# Altium project UCLA-DRS4.PrjPCB (part 3 of 10)

## Sheet DRS4_ADC.SchDoc: My title
size A3; Organization: University of California; Address1: 475 Portola Plaza; Address2: Los Angeles, CA 90095; DocumentNumber: 22; Revision: R01; SheetNumber: 22; SheetTotal: 35
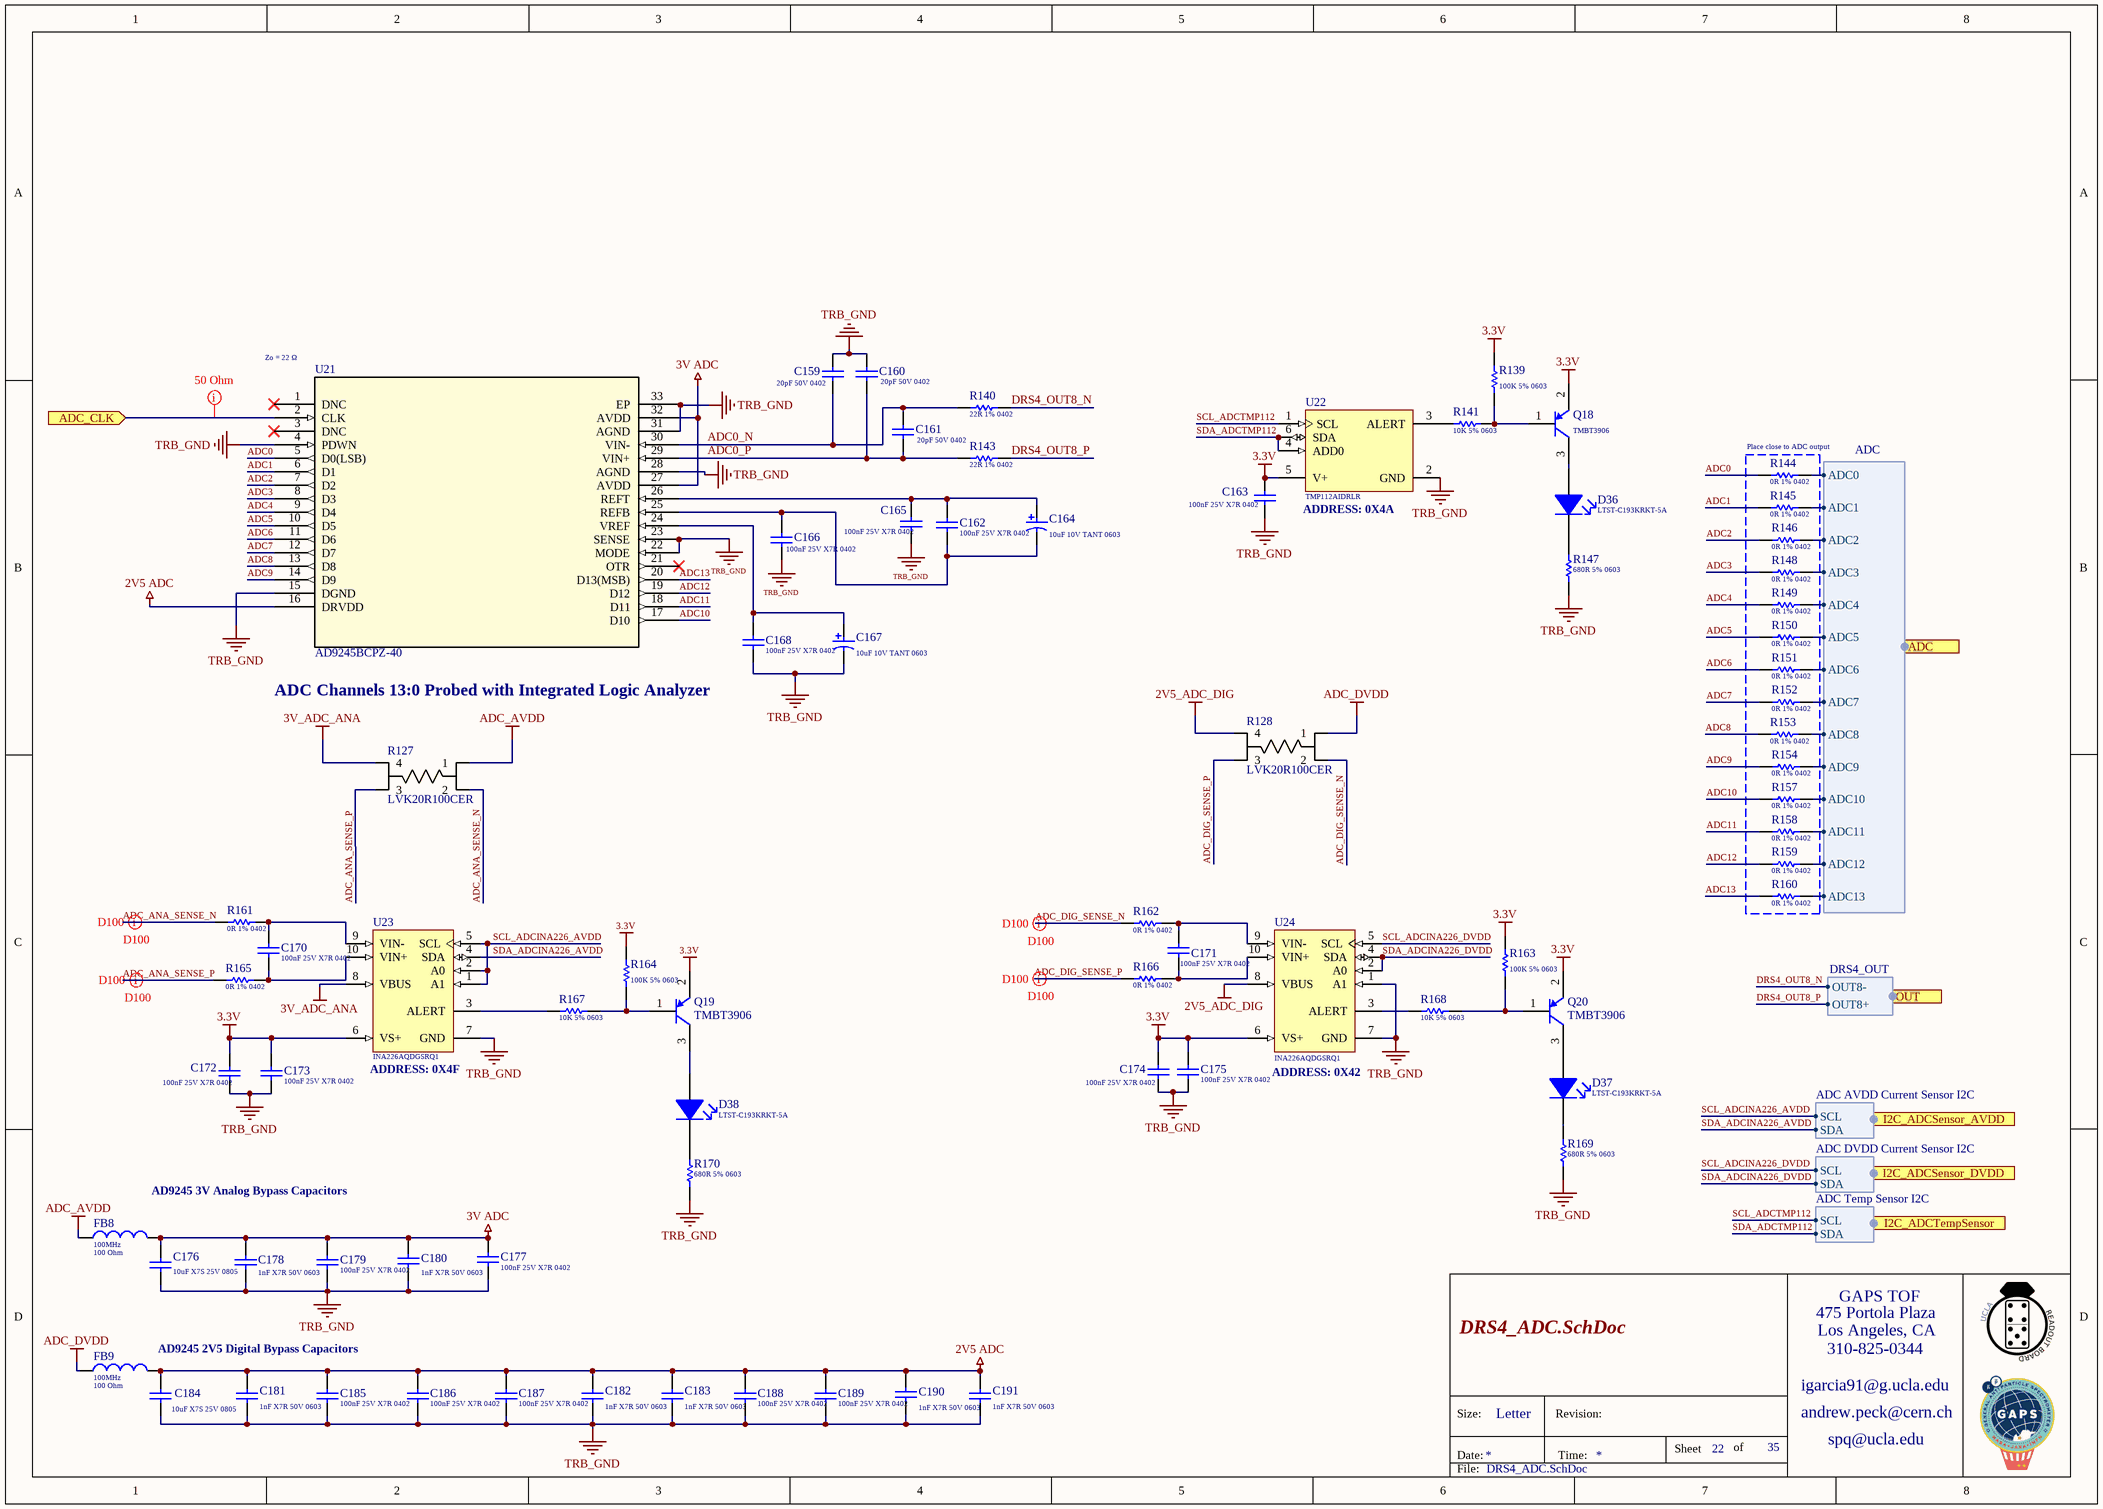
[diagram p4: DRS4_ADC.SchDoc]

### Parts
C159  Capacitance: 20pF 50V 0402  [Cap_Murata_GJM1555C1H200GB01D_20pF]  (hidden comment: Cap_Murata_GJM1555C1H200GB01D_20pF)
C160  Capacitance: 20pF 50V 0402  [Cap_Murata_GJM1555C1H200GB01D_20pF]  (hidden comment: Cap_Murata_GJM1555C1H200GB01D_20pF)
C161  Capacitance: 20pF 50V 0402  [Cap_Murata_GJM1555C1H200GB01D_20pF]  (hidden comment: Cap_Murata_GJM1555C1H200GB01D_20pF)
C162  Capacitance: 100nF 25V X7R 0402  [Cap_Taiyo_Yuden_TMK105B7104KV-FR_100nF]  (hidden comment: Cap_Taiyo_Yuden_TMK105B7104KV-FR_100nF)
C163  Capacitance: 100nF 25V X7R 0402  [Cap_Taiyo_Yuden_TMK105B7104KV-FR_100nF]  (hidden comment: Cap_Taiyo_Yuden_TMK105B7104KV-FR_100nF)
C164  10uF 10V TANT 0603  [VISH-TR8-M_L]
C165  Capacitance: 100nF 25V X7R 0402  [Cap_Taiyo_Yuden_TMK105B7104KV-FR_100nF]  (hidden comment: Cap_Taiyo_Yuden_TMK105B7104KV-FR_100nF)
C166  Capacitance: 100nF 25V X7R 0402  [Cap_Taiyo_Yuden_TMK105B7104KV-FR_100nF]  (hidden comment: Cap_Taiyo_Yuden_TMK105B7104KV-FR_100nF)
C167  10uF 10V TANT 0603  [VISH-TR8-M_L]
C168  Capacitance: 100nF 25V X7R 0402  [Cap_Taiyo_Yuden_TMK105B7104KV-FR_100nF]  (hidden comment: Cap_Taiyo_Yuden_TMK105B7104KV-FR_100nF)
C170  Capacitance: 100nF 25V X7R 0402  [Cap_Taiyo_Yuden_TMK105B7104KV-FR_100nF]  (hidden comment: Cap_Taiyo_Yuden_TMK105B7104KV-FR_100nF)
C171  Capacitance: 100nF 25V X7R 0402  [Cap_Taiyo_Yuden_TMK105B7104KV-FR_100nF]  (hidden comment: Cap_Taiyo_Yuden_TMK105B7104KV-FR_100nF)
C172  Capacitance: 100nF 25V X7R 0402  [Cap_Taiyo_Yuden_TMK105B7104KV-FR_100nF]  (hidden comment: Cap_Taiyo_Yuden_TMK105B7104KV-FR_100nF)
C173  Capacitance: 100nF 25V X7R 0402  [Cap_Taiyo_Yuden_TMK105B7104KV-FR_100nF]  (hidden comment: Cap_Taiyo_Yuden_TMK105B7104KV-FR_100nF)
C174  Capacitance: 100nF 25V X7R 0402  [Cap_Taiyo_Yuden_TMK105B7104KV-FR_100nF]  (hidden comment: Cap_Taiyo_Yuden_TMK105B7104KV-FR_100nF)
C175  Capacitance: 100nF 25V X7R 0402  [Cap_Taiyo_Yuden_TMK105B7104KV-FR_100nF]  (hidden comment: Cap_Taiyo_Yuden_TMK105B7104KV-FR_100nF)
C176  Capacitance: 10uF X7S 25V 0805  [Cap_Murata_ GRM21BC71E106ME11L_10uF]  (hidden comment: Cap_Murata_ GRM21BC71E106ME11L_10uF)
C177  Capacitance: 100nF 25V X7R 0402  [Cap_Taiyo_Yuden_TMK105B7104KV-FR_100nF]  (hidden comment: Cap_Taiyo_Yuden_TMK105B7104KV-FR_100nF)
C178  Capacitance: 1nF X7R 50V 0603  [Cap_Kemet_C0603C102J5RACAUTO_1nF]  (hidden comment: Cap_Kemet_C0603C102J5RACAUTO_1nF)
C179  Capacitance: 100nF 25V X7R 0402  [Cap_Taiyo_Yuden_TMK105B7104KV-FR_100nF]  (hidden comment: Cap_Taiyo_Yuden_TMK105B7104KV-FR_100nF)
C180  Capacitance: 1nF X7R 50V 0603  [Cap_Kemet_C0603C102J5RACAUTO_1nF]  (hidden comment: Cap_Kemet_C0603C102J5RACAUTO_1nF)
C181  Capacitance: 1nF X7R 50V 0603  [Cap_Kemet_C0603C102J5RACAUTO_1nF]  (hidden comment: Cap_Kemet_C0603C102J5RACAUTO_1nF)
C182  Capacitance: 1nF X7R 50V 0603  [Cap_Kemet_C0603C102J5RACAUTO_1nF]  (hidden comment: Cap_Kemet_C0603C102J5RACAUTO_1nF)
C183  Capacitance: 1nF X7R 50V 0603  [Cap_Kemet_C0603C102J5RACAUTO_1nF]  (hidden comment: Cap_Kemet_C0603C102J5RACAUTO_1nF)
C184  Capacitance: 10uF X7S 25V 0805  [Cap_Murata_ GRM21BC71E106ME11L_10uF]  (hidden comment: Cap_Murata_ GRM21BC71E106ME11L_10uF)
C185  Capacitance: 100nF 25V X7R 0402  [Cap_Taiyo_Yuden_TMK105B7104KV-FR_100nF]  (hidden comment: Cap_Taiyo_Yuden_TMK105B7104KV-FR_100nF)
C186  Capacitance: 100nF 25V X7R 0402  [Cap_Taiyo_Yuden_TMK105B7104KV-FR_100nF]  (hidden comment: Cap_Taiyo_Yuden_TMK105B7104KV-FR_100nF)
C187  Capacitance: 100nF 25V X7R 0402  [Cap_Taiyo_Yuden_TMK105B7104KV-FR_100nF]  (hidden comment: Cap_Taiyo_Yuden_TMK105B7104KV-FR_100nF)
C188  Capacitance: 100nF 25V X7R 0402  [Cap_Taiyo_Yuden_TMK105B7104KV-FR_100nF]  (hidden comment: Cap_Taiyo_Yuden_TMK105B7104KV-FR_100nF)
C189  Capacitance: 100nF 25V X7R 0402  [Cap_Taiyo_Yuden_TMK105B7104KV-FR_100nF]  (hidden comment: Cap_Taiyo_Yuden_TMK105B7104KV-FR_100nF)
C190  Capacitance: 1nF X7R 50V 0603  [Cap_Kemet_C0603C102J5RACAUTO_1nF]  (hidden comment: Cap_Kemet_C0603C102J5RACAUTO_1nF)
C191  Capacitance: 1nF X7R 50V 0603  [Cap_Kemet_C0603C102J5RACAUTO_1nF]  (hidden comment: Cap_Kemet_C0603C102J5RACAUTO_1nF)
D36  LTST-C193KRKT-5A  [Led_Lite-On_LTST-C193KGKT-5A_Red]
D37  LTST-C193KRKT-5A  [Led_Lite-On_LTST-C193KGKT-5A_Red]
D38  LTST-C193KRKT-5A  [Led_Lite-On_LTST-C193KGKT-5A_Red]
FB8  Measuring Frequency: 100MHz  Impedance: 100 Ohm  [FB_Wurth_Electronics_742792731_100Ohms]  (hidden comment: 742792731)
FB9  Measuring Frequency: 100MHz  Impedance: 100 Ohm  [FB_Wurth_Electronics_742792731_100Ohms]  (hidden comment: 742792731)
Q18  Series: TMBT3906  [BJT_PNP_Toshiba_TMBT3906]  (hidden comment: BJT_PNP_Toshiba_TMBT3906)
Q19  Series: TMBT3906  [BJT_PNP_Toshiba_TMBT3906]  (hidden comment: BJT_PNP_Toshiba_TMBT3906)
Q20  Series: TMBT3906  [BJT_PNP_Toshiba_TMBT3906]  (hidden comment: BJT_PNP_Toshiba_TMBT3906)
R127  LVK20R100CER  [OH_LVK20_OHM]
R128  LVK20R100CER  [OH_LVK20_OHM]
R139  100K 5% 0603  [RESC0603(1608)_N]
R140  22R 1% 0402  [RESC0402(1005)_L]
R141  10K 5% 0603  [RESC0603(1608)_L]
R143  22R 1% 0402  [RESC0402(1005)_L]
R144  Resistance: 0R 1% 0402  [Res_Vishay_CRCW04020000Z0EDC_0_Ohm]  (hidden comment: Res_Vishay_CRCW04020000Z0EDC_0_Ohm)
R145  Resistance: 0R 1% 0402  [Res_Vishay_CRCW04020000Z0EDC_0_Ohm]  (hidden comment: Res_Vishay_CRCW04020000Z0EDC_0_Ohm)
R146  Resistance: 0R 1% 0402  [Res_Vishay_CRCW04020000Z0EDC_0_Ohm]  (hidden comment: Res_Vishay_CRCW04020000Z0EDC_0_Ohm)
R147  680R 5% 0603  [RESC0603(1608)_L]
R148  Resistance: 0R 1% 0402  [Res_Vishay_CRCW04020000Z0EDC_0_Ohm]  (hidden comment: Res_Vishay_CRCW04020000Z0EDC_0_Ohm)
R149  Resistance: 0R 1% 0402  [Res_Vishay_CRCW04020000Z0EDC_0_Ohm]  (hidden comment: Res_Vishay_CRCW04020000Z0EDC_0_Ohm)
R150  Resistance: 0R 1% 0402  [Res_Vishay_CRCW04020000Z0EDC_0_Ohm]  (hidden comment: Res_Vishay_CRCW04020000Z0EDC_0_Ohm)
R151  Resistance: 0R 1% 0402  [Res_Vishay_CRCW04020000Z0EDC_0_Ohm]  (hidden comment: Res_Vishay_CRCW04020000Z0EDC_0_Ohm)
R152  Resistance: 0R 1% 0402  [Res_Vishay_CRCW04020000Z0EDC_0_Ohm]  (hidden comment: Res_Vishay_CRCW04020000Z0EDC_0_Ohm)
R153  Resistance: 0R 1% 0402  [Res_Vishay_CRCW04020000Z0EDC_0_Ohm]  (hidden comment: Res_Vishay_CRCW04020000Z0EDC_0_Ohm)
R154  Resistance: 0R 1% 0402  [Res_Vishay_CRCW04020000Z0EDC_0_Ohm]  (hidden comment: Res_Vishay_CRCW04020000Z0EDC_0_Ohm)
R157  Resistance: 0R 1% 0402  [Res_Vishay_CRCW04020000Z0EDC_0_Ohm]  (hidden comment: Res_Vishay_CRCW04020000Z0EDC_0_Ohm)
R158  Resistance: 0R 1% 0402  [Res_Vishay_CRCW04020000Z0EDC_0_Ohm]  (hidden comment: Res_Vishay_CRCW04020000Z0EDC_0_Ohm)
R159  Resistance: 0R 1% 0402  [Res_Vishay_CRCW04020000Z0EDC_0_Ohm]  (hidden comment: Res_Vishay_CRCW04020000Z0EDC_0_Ohm)
R160  Resistance: 0R 1% 0402  [Res_Vishay_CRCW04020000Z0EDC_0_Ohm]  (hidden comment: Res_Vishay_CRCW04020000Z0EDC_0_Ohm)
R161  Resistance: 0R 1% 0402  [Res_Vishay_CRCW04020000Z0EDC_0_Ohm]  (hidden comment: Res_Vishay_CRCW04020000Z0EDC_0_Ohm)
R162  Resistance: 0R 1% 0402  [Res_Vishay_CRCW04020000Z0EDC_0_Ohm]  (hidden comment: Res_Vishay_CRCW04020000Z0EDC_0_Ohm)
R163  100K 5% 0603  [RESC0603(1608)_N]
R164  100K 5% 0603  [RESC0603(1608)_N]
R165  Resistance: 0R 1% 0402  [Res_Vishay_CRCW04020000Z0EDC_0_Ohm]  (hidden comment: Res_Vishay_CRCW04020000Z0EDC_0_Ohm)
R166  Resistance: 0R 1% 0402  [Res_Vishay_CRCW04020000Z0EDC_0_Ohm]  (hidden comment: Res_Vishay_CRCW04020000Z0EDC_0_Ohm)
R167  10K 5% 0603  [RESC0603(1608)_L]
R168  10K 5% 0603  [RESC0603(1608)_L]
R169  680R 5% 0603  [RESC0603(1608)_L]
R170  680R 5% 0603  [RESC0603(1608)_L]
U21  AD9245  [CP_32_2]  (value not drawn)
U22  TMP112AIDRLR  [TMP112AIDRLR]
U23  INA226AQDGSRQ1  [INA226AQDGSRQ1]
U24  INA226AQDGSRQ1  [INA226AQDGSRQ1]

### Blocks framed on the sheet
Place close to ADC output: R144-R146 R148-R154 R157-R160

### Ports
ADC (harness ADC), ADC_CLK (in), I2C_ADCSensor_AVDD (harness ADC AVDD Current Sensor I2C), I2C_ADCSensor_DVDD (harness ADC DVDD Current Sensor I2C), I2C_ADCTempSensor (harness ADC Temp Sensor I2C), OUT (harness DRS4_OUT)

### Harnesses
ADC: ADC0, ADC1, ADC2, ADC3, ADC4, ADC5, ADC6, ADC7, ADC8, ADC9, ADC10, ADC11, ADC12, ADC13
DRS4_OUT: OUT8+, OUT8-
ADC AVDD Current Sensor I2C: SCL, SDA
ADC Temp Sensor I2C: SCL, SDA
ADC DVDD Current Sensor I2C: SCL, SDA

### Nets
2V5 ADC: C181.2 C182.2 C183.2 C184.1 C185.1 C186.1 C187.1 C188.1 C189.1 C190.2 C191.2 FB9.2 U21.16(DRVDD)
2V5_ADC_DIG: R128.4 U24.8(VBUS)
3.3V: C163.1 C172.2 C173.2 C174.2 C175.2 Q18.2(E) Q19.2(E) Q20.2(E) R139.2 R163.2 R164.2 U22.5(V+) U23.6(VS+) U24.6(VS+)
3V ADC: C176.1 C177.1 C178.2 C179.1 C180.2 FB8.2 U21.27(AVDD) U21.32(AVDD)
3V_ADC_ANA: R127.4 U23.8(VBUS)
ADC_AVDD: FB8.1 R127.1
ADC_DVDD: FB9.1 R128.1
TRB_GND: C159.2 C160.2 C163.2 C165.2 C166.2 C167.2 C168.2 C172.1 C173.1 C174.1 C175.1 C176.2 C177.2 C178.1 C179.2 C180.1 C181.1 C182.1 C183.1 C184.2 C185.2 C186.2 C187.2 C188.2 C189.2 C190.1 C191.1 R147.1 R169.1 R170.1 U21.4(PDWN) U21.15(DGND) U21.22(MODE) U21.23(SENSE) U21.28(AGND) U21.31(AGND) U21.33(EP) U22.2(GND) U23.7(GND) U24.1(A1) U24.7(GND)
ADC0: R144.1 U21.5(D0(LSB))
ADC0_N: C159.1 C161.2 R140.2 U21.30(VIN-)
ADC0_P: C160.1 C161.1 R143.2 U21.29(VIN+)
ADC1: R145.1 U21.6(D1)
ADC2: R146.1 U21.7(D2)
ADC3: R148.1 U21.8(D3)
ADC4: R149.1 U21.9(D4)
ADC5: R150.1 U21.10(D5)
ADC6: R151.1 U21.11(D6)
ADC7: R152.1 U21.12(D7)
ADC8: R153.1 U21.13(D8)
ADC9: R154.1 U21.14(D9)
ADC10: R157.1 U21.17(D10)
ADC11: R158.1 U21.18(D11)
ADC12: R159.1 U21.19(D12)
ADC13: R160.1 U21.20(D13(MSB))
ADC_ANA_SENSE_N: R127.2 R161.1
ADC_ANA_SENSE_P: R127.3 R165.1
ADC_CLK: U21.2(CLK) ; port ADC_CLK
ADC_DIG_SENSE_N: R128.2 R162.1
ADC_DIG_SENSE_P: R128.3 R166.1
DRS4_OUT8_N: R140.1 ; port OUT.OUT8-
DRS4_OUT8_P: R143.1 ; port OUT.OUT8+
IO_B34_L7_Y16_P: R157.2 ; port ADC.ADC10
IO_B34_L7_Y17_N: R154.2 ; port ADC.ADC9
IO_B34_L10_V15_P: R159.2 ; port ADC.ADC12
IO_B34_L10_W15_N: R158.2 ; port ADC.ADC11
IO_B34_L17_Y18_P: R153.2 ; port ADC.ADC8
IO_B34_L17_Y19_N: R152.2 ; port ADC.ADC7
IO_B34_L19_R17_N: R160.2 ; port ADC.ADC13
IO_B34_L22_W18_P: R151.2 ; port ADC.ADC6
IO_B34_L22_W19_N: R150.2 ; port ADC.ADC5
IO_B35_L7_M19_P: R146.2 ; port ADC.ADC2
IO_B35_L7_M20_N: R145.2 ; port ADC.ADC1
IO_B35_L9_L19_P: R144.2 ; port ADC.ADC0
IO_B35_L21_N15_P: R149.2 ; port ADC.ADC4
IO_B35_L21_N16_N: R148.2 ; port ADC.ADC3
SCL_ADCINA226_AVDD: U23.1(A1) U23.2(A0) U23.5(SCL) ; port I2C_ADCSensor_AVDD.SCL
SCL_ADCINA226_DVDD: U24.5(SCL) ; port I2C_ADCSensor_DVDD.SCL
SCL_ADCTMP112: U22.1(SCL) ; port I2C_ADCTempSensor.SCL
SDA_ADCINA226_AVDD: U23.4(SDA) ; port I2C_ADCSensor_AVDD.SDA
SDA_ADCINA226_DVDD: U24.2(A0) U24.4(SDA) ; port I2C_ADCSensor_DVDD.SDA
SDA_ADCTMP112: U22.4(ADD0) U22.6(SDA) ; port I2C_ADCTempSensor.SDA
NetC162_1: C162.1 C164.2 C166.1 U21.25(REFB)
NetC162_2: C162.2 C164.1 C165.1 U21.26(REFT)
NetC167_1: C167.1 C168.1 U21.24(VREF)
NetC170_1: C170.1 R165.2 U23.10(VIN+)
NetC170_2: C170.2 R161.2 U23.9(VIN-)
NetC171_1: C171.1 R166.2 U24.10(VIN+)
NetC171_2: C171.2 R162.2 U24.9(VIN-)
NetD36_1: D36.1(K) R147.2
NetD36_2: D36.2(A) Q18.3(C)
NetD37_1: D37.1(K) R169.2
NetD37_2: D37.2(A) Q20.3(C)
NetD38_1: D38.1(K) R170.2
NetD38_2: D38.2(A) Q19.3(C)
NetQ18_1: Q18.1(B) R139.1 R141.1
NetQ19_1: Q19.1(B) R164.1 R167.1
NetQ20_1: Q20.1(B) R163.1 R168.1
NetR141_2: R141.2 U22.3(ALERT)
NetR167_2: R167.2 U23.3(ALERT)
NetR168_2: R168.2 U24.3(ALERT)

Not connected (* = marked no-connect by the designer): U21 1(DNC)* 3(DNC)* 21(OTR)*

### Layout directives
net class S50: ADC_CLK
differential pair; differential pair class D100: ADC_ANA_SENSE_N, ADC_ANA_SENSE_P, ADC_DIG_SENSE_N, ADC_DIG_SENSE_P

### Notes on the sheet
- (near U21) Zo = 22 Ω
- ADDRESS: 0X4A
- (near C168) ADC Channels 13:0 Probed with Integrated Logic Analyzer
- D100
- (near U23) ADDRESS: 0X4F
- (near U24) ADDRESS: 0X42
- AD9245 3V Analog Bypass Capacitors
- (near FB9) AD9245 2V5 Digital Bypass Capacitors
- 475 Portola Plaza
- GAPS TOF
- igarcia91@g.ucla.edu
- Los Angeles, CA
- 310-825-0344
- Size:
- Date:
- Letter
- Revision:
- Time:
- Sheet
- of
- andrew.peck@cern.ch
- spq@ucla.edu
- File:

### Library data of the parts
C159-C161 = Cap_Murata_GJM1555C1H200GB01D_20pF: Multilayer Ceramic Capacitors MLCC - SMD/SMT 0402 20pF 50Volts C0G 2%; Supplier 1: Mouser; Supplier Part Number 1: 81-GJM1555C1H200GB01
C162 C163 C165 C166 C168 C170-C175 C177 C179 C185-C189 = Cap_Taiyo_Yuden_TMK105B7104KV-FR_100nF: CAP CER 100nF 25V X7R 0402; Supplier 1: Mouser; Supplier Part Number 1: 963-TMK105B7104KV-FR
C164 C167 = CMP-2000-07316-1: Tantalum Capacitor, 10 uF, +/- 20%, 10 V, -55 to 125 degC, 2-Pin SMD (M), RoHS, Tape and Reel; Manufacturer: Vishay; Manufacturer Part Number: TR8M106M010C2000; Capacitance: 10µF; Featured Product: TR8SeriesMoldedMicroTan™TantalumChipCapacitors; ESR (Equivalent Series Resistance): 2Ohm; Other Names: 718-1673-6; Catalog Drawings: TR8SeriesTR8SeriesBottom; Online Catalog: MICROTAN®TR8Series; Type: Molded; Mounting Technology: SurfaceMount; Category: Capacitors; Lifetime @ Temp.: -; Package Reference: TR8-M; Size / Dimension: 0.063"Lx0.033"W(1.60mmx0.85mm); Operating Temperature: -55°C~125°C; Mounting Type: SurfaceMount; Lead Spacing: -; Tolerance: ±20%; Standard Package: 1; Datasheet URL: http://www.vishay.com/docs/40114/tr8.pdf; Package Description: 2-Pin Surface Mount Device, Body 1.6 x 0.85 mm; Height - Seated (Max): 0.035"(0.89mm); Family: TantalumCapacitors; Manufacturer Size Code: M; Voltage - Rated: 10V; Series: MICROTAN®TR8; Packaging: Digi-Reel®; Manufacturer URL: http://www.vishay.com/; Datasheet Version: 03/2016; Package / Case: 0603(1608Metric); Features: GeneralPurpose
C176 C184 = Cap_Murata_ GRM21BC71E106ME11L_10uF: CAP CER 10uF 25V X7R 0805; Supplier 1: Mouser; Supplier Part Number 1: 81-GRM21BC71E106ME1L
C178 C180-C183 C190 C191 = Cap_Kemet_C0603C102J5RACAUTO_1nF: CAP CER 1nF 50V X7R 0603; Supplier 1: Mouser; Supplier Part Number 1: 80-C0603C102J5RAUTO
D36-D38 = Led_Lite-On_LTST-C193KGKT-5A_Red: Standard LEDs - SMD Red 470nm 28mcd 20mA; Supplier 1: Mouser; Supplier Part Number 1: 859-LTSTC193KRKT5A; Series: LTST-C193KRKT-5A
FB8 FB9 = FB_Wurth_Electronics_742792731_100Ohms: FB SMD 100 OHM 25% 1.2A 0402; DC Resistance: 90mOhm; Supplier 1: Mouser; Supplier Part Number 1: 710-742792731
Q18-Q20 = BJT_PNP_Toshiba_TMBT3906: Bipolar Transistors - BJT Transistor for Low Freq. Amplification; Manufacturer Part Number 1: TMBT3906,LM; Supplier 1: Mouser; Supplier Part Number 1: 757-TMBT3906LM; Manufacturer: Toshiba
R127 R128 = LVK20R100CER: Current Sense Resistors - SMD .1 OHM.25% 3/4W; Vendor: Ohmite; Built_By: EMA_UL_Team; SourceLibrary: Ohmite_2014-12-31; Manufacturer_Part_Number: LVK20R100CER; Copyright: Copyright (C) 2018 Accelerated Designs. All rights reserved; RefDes: RefDes; Type: DEV
R139 R163 R164 = CMP-1012-00122-1: 100K 0.1W 5% 0603 (1608 Metric)  SMD; Case-EIA: 0603; Value: 100000.00 Ohm; Case-Metric: 1608; Tolerance: 5 %; Power: 0.1 W; Technology: SMT
R140 R143 = CMP-1011-00320-1: 22R 0.063W 1% 0402 (1005 Metric)  SMD; Case-EIA: 0402; Case-Metric: 1005; Value: 22.00 Ohm; Tolerance: 1 %; Technology: SMT; Power: 0.063 W
R141 R167 R168 = CMP-1012-00098-1: 10K 0.1W 5% 0603 (1608 Metric)  SMD; Case-EIA: 0603; Value: 10000.00 Ohm; Case-Metric: 1608; Technology: SMT; Tolerance: 5 %; Power: 0.1 W
R144-R146 R148-R154 R157-R162 R165 R166 = Res_Vishay_CRCW04020000Z0EDC_0_Ohm: 0R 0.062W 1% 0402 (1005 Metric)  SMD; Supplier 1: Mouser; Supplier Part Number 1: 71-CRCW04020000Z0EDC
R147 R169 R170 = CMP-1012-00070-1: 680R 0.1W 5% 0603 (1608 Metric)  SMD; Case-EIA: 0603; Value: 680.00 Ohm; Case-Metric: 1608; Tolerance: 5 %; Technology: SMT; Power: 0.1 W
U21 = AD9245BCPZ-40: Analog to Digital Converters - ADC 14-Bit 40 MSPS 3V; Vendor: Analog Devices Inc; Built_By: EMA_UL_Team; C: Copyright (C) 2015 Accelerated Designs. All rights reserved; RefDes: RefDes; Type: DEV; Supplier 1: Mouser; Supplier Part Number 1: 584-AD9245BCPZ-40; Series: AD9245BCPZ-40; Part: AD9245BCPZ-40
U22 = TMP112AIDRLR: Board Mount Temperature Sensors Hi-Prec Lo-Pwr Dig Temp Sensor; Supplier 1: Mouser; Supplier Part Number 1: 595-TMP112AIDRLR
U23 U24 = INA226AQDGSRQ1: Current & Power Monitors & Regulators Automotive, 36-V, Ultra-High Accuracy, Low-/High-Side, I2C Out Current/Power Monitor w/ Alert 10-VSSOP -40 to 125; Supplier 1: Mouser; Supplier Part Number 1: 595-INA226AQDGSRQ1

## Sheet ANA_FE_CLK_SYNTH.SchDoc: My title
size A3; Organization: University of California; Address1: 475 Portola Plaza; Address2: Los Angeles, CA 90095; DocumentNumber: 29; Revision: R01; SheetNumber: 29; SheetTotal: 35
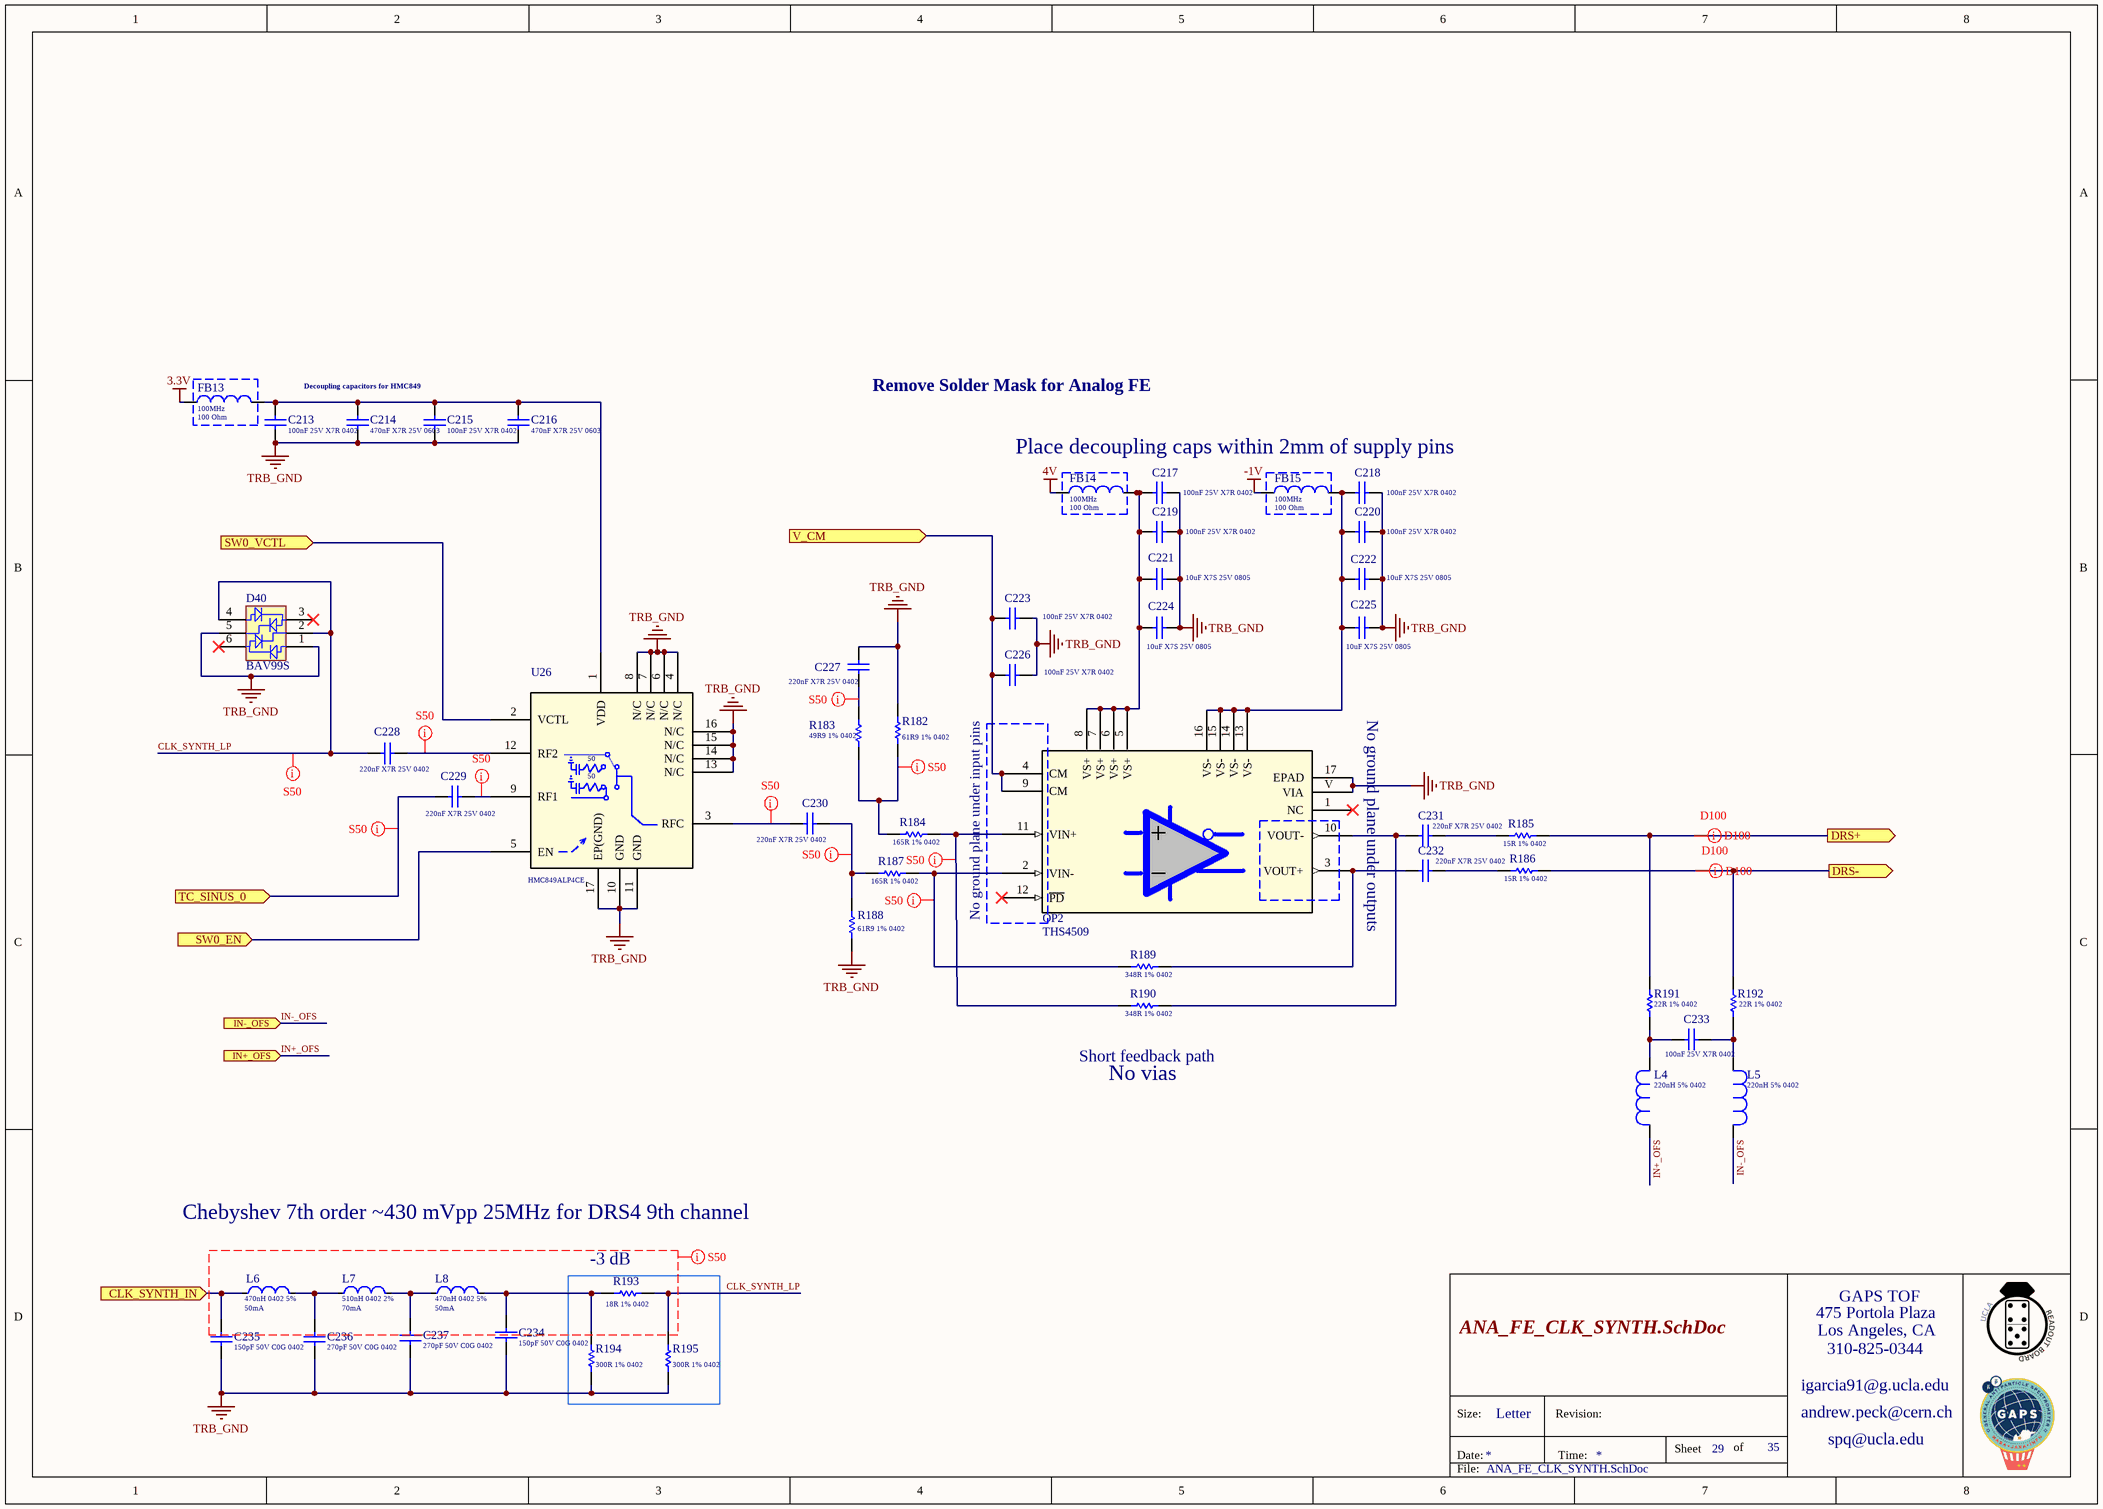
[diagram p5: ANA_FE_CLK_SYNTH.SchDoc]

### Parts
C213  Capacitance: 100nF 25V X7R 0402  [Cap_Taiyo_Yuden_TMK105B7104KV-FR_100nF]  (hidden comment: Cap_Taiyo_Yuden_TMK105B7104KV-FR_100nF)
C214  Capacitance: 470nF X7R 25V 0603  [Cap_Wurth_Electronics_885012206075_470nF]  (hidden comment: Cap_Wurth_Electronics_885012206075_470nF)
C215  Capacitance: 100nF 25V X7R 0402  [Cap_Taiyo_Yuden_TMK105B7104KV-FR_100nF]  (hidden comment: Cap_Taiyo_Yuden_TMK105B7104KV-FR_100nF)
C216  Capacitance: 470nF X7R 25V 0603  [Cap_Wurth_Electronics_885012206075_470nF]  (hidden comment: Cap_Wurth_Electronics_885012206075_470nF)
C217  Capacitance: 100nF 25V X7R 0402  [Cap_Taiyo_Yuden_TMK105B7104KV-FR_100nF]  (hidden comment: Cap_Taiyo_Yuden_TMK105B7104KV-FR_100nF)
C218  Capacitance: 100nF 25V X7R 0402  [Cap_Taiyo_Yuden_TMK105B7104KV-FR_100nF]  (hidden comment: Cap_Taiyo_Yuden_TMK105B7104KV-FR_100nF)
C219  Capacitance: 100nF 25V X7R 0402  [Cap_Taiyo_Yuden_TMK105B7104KV-FR_100nF]  (hidden comment: Cap_Taiyo_Yuden_TMK105B7104KV-FR_100nF)
C220  Capacitance: 100nF 25V X7R 0402  [Cap_Taiyo_Yuden_TMK105B7104KV-FR_100nF]  (hidden comment: Cap_Taiyo_Yuden_TMK105B7104KV-FR_100nF)
C221  Capacitance: 10uF X7S 25V 0805  [Cap_Murata_ GRM21BC71E106ME11L_10uF]  (hidden comment: Cap_Murata_ GRM21BC71E106ME11L_10uF)
C222  Capacitance: 10uF X7S 25V 0805  [Cap_Murata_ GRM21BC71E106ME11L_10uF]  (hidden comment: Cap_Murata_ GRM21BC71E106ME11L_10uF)
C223  Capacitance: 100nF 25V X7R 0402  [Cap_Taiyo_Yuden_TMK105B7104KV-FR_100nF]  (hidden comment: Cap_Taiyo_Yuden_TMK105B7104KV-FR_100nF)
C224  Capacitance: 10uF X7S 25V 0805  [Cap_Murata_ GRM21BC71E106ME11L_10uF]  (hidden comment: Cap_Murata_ GRM21BC71E106ME11L_10uF)
C225  Capacitance: 10uF X7S 25V 0805  [Cap_Murata_ GRM21BC71E106ME11L_10uF]  (hidden comment: Cap_Murata_ GRM21BC71E106ME11L_10uF)
C226  Capacitance: 100nF 25V X7R 0402  [Cap_Taiyo_Yuden_TMK105B7104KV-FR_100nF]  (hidden comment: Cap_Taiyo_Yuden_TMK105B7104KV-FR_100nF)
C227  Capacitance: 220nF X7R 25V 0402  [Cap_TDK_C1608X5R1A106M080AC_220nF]  (hidden comment: Cap_TDK_C1608X5R1A106M080AC_220nF)
C228  Capacitance: 220nF X7R 25V 0402  [Cap_TDK_C1608X5R1A106M080AC_220nF]  (hidden comment: Cap_TDK_C1608X5R1A106M080AC_220nF)
C229  Capacitance: 220nF X7R 25V 0402  [Cap_TDK_C1608X5R1A106M080AC_220nF]  (hidden comment: Cap_TDK_C1608X5R1A106M080AC_220nF)
C230  Capacitance: 220nF X7R 25V 0402  [Cap_TDK_C1608X5R1A106M080AC_220nF]  (hidden comment: Cap_TDK_C1608X5R1A106M080AC_220nF)
C231  Capacitance: 220nF X7R 25V 0402  [Cap_TDK_C1608X5R1A106M080AC_220nF]  (hidden comment: Cap_TDK_C1608X5R1A106M080AC_220nF)
C232  Capacitance: 220nF X7R 25V 0402  [Cap_TDK_C1608X5R1A106M080AC_220nF]  (hidden comment: Cap_TDK_C1608X5R1A106M080AC_220nF)
C233  Capacitance: 100nF 25V X7R 0402  [Cap_Taiyo_Yuden_TMK105B7104KV-FR_100nF]  (hidden comment: Cap_Taiyo_Yuden_TMK105B7104KV-FR_100nF)
C234  Capacitance: 150pF 50V C0G 0402  [Cap_TDK_CGA2B2C0G2A151J050BE_150pF]  (hidden comment: Cap_TDK_CGA2B2C0G2A151J050BE_150pF)
C235  Capacitance: 150pF 50V C0G 0402  [Cap_TDK_CGA2B2C0G2A151J050BE_150pF]  (hidden comment: Cap_TDK_CGA2B2C0G2A151J050BE_150pF)
C236  Capacitance: 270pF 50V C0G 0402  [Cap_Murata_GCM1555C1H271FA16D_270pF]  (hidden comment: Cap_Murata_GCM1555C1H271FA16D_270pF)
C237  Capacitance: 270pF 50V C0G 0402  [Cap_Murata_GCM1555C1H271FA16D_270pF]  (hidden comment: Cap_Murata_GCM1555C1H271FA16D_270pF)
D40  BAV99S  [INF-SOT363_V]
FB13  Measuring Frequency: 100MHz  Impedance: 100 Ohm  [FB_Wurth_Electronics_742792731_100Ohms]  (hidden comment: 742792731)
FB14  Measuring Frequency: 100MHz  Impedance: 100 Ohm  [FB_Wurth_Electronics_742792731_100Ohms]  (hidden comment: 742792731)
FB15  Measuring Frequency: 100MHz  Impedance: 100 Ohm  [FB_Wurth_Electronics_742792731_100Ohms]  (hidden comment: 742792731)
L4  Inductance: 220nH 5% 0402  [Ind_TDK_ MLG1005SR22JT000_220nH]  (hidden comment: Ind_TDK_ MLG1005SR22JT000_220nH)
L5  Inductance: 220nH 5% 0402  [Ind_TDK_ MLG1005SR22JT000_220nH]  (hidden comment: Ind_TDK_ MLG1005SR22JT000_220nH)
L6  470nH 0402 5%  Current Rating: 50mA  [TDK_MLF1005GR47JT000_0]
L7  510nH 0402 2%  Current Rating: 70mA  [TDK_MHQ1005PR51GT000_0]
L8  470nH 0402 5%  Current Rating: 50mA  [TDK_MLF1005GR47JT000_0]
OP2  THS4509  [RGT16]
R182  61R9 1% 0402  [RESC0402(1005)_L]
R183  49R9 1% 0402  [RESC0402(1005)_L]
R184  165R 1% 0402  [RESC0402(1005)_L]
R185  15R 1% 0402  [RESC0402(1005)_L]
R186  15R 1% 0402  [RESC0402(1005)_L]
R187  165R 1% 0402  [RESC0402(1005)_L]
R188  61R9 1% 0402  [RESC0402(1005)_L]
R189  348R 1% 0402  [RESC0402(1005)_L]
R190  348R 1% 0402  [RESC0402(1005)_L]
R191  22R 1% 0402  [RESC0402(1005)_L]
R192  22R 1% 0402  [RESC0402(1005)_L]
R193  18R 1% 0402  [RESC0402(1005)_L]
R194  300R 1% 0402  [RESC0402(1005)_L]
R195  300R 1% 0402  [RESC0402(1005)_L]
U26  HMC849  [CP_16_40]  (value not drawn)

### Blocks framed on the sheet
-3 dB: R193-R195

### Ports
CLK_SYNTH_IN (in), DRS+ (out), DRS- (out), IN+_OFS (in), IN-_OFS (in), SW0_EN (in), SW0_VCTL (in), TC_SINUS_0 (in), V_CM (in)

### Nets
3.3V: FB13.1
4V: FB14.1
-1V: FB15.1  [project net -1V_VBUS]
TRB_GND: C213.1 C214.2 C215.1 C216.2 C217.2 C218.2 C219.2 C220.2 C221.1 C222.1 C223.2 C224.1 C225.1 C226.2 C227.1 C234.1 C235.1 C236.1 C237.1 D40.1(A1) D40.5(K5) OP2.17(EPAD) OP2.V(VIA) R182.2 R188.1 R194.1 R195.1 U26.4(N/C) U26.6(N/C) U26.7(N/C) U26.8(N/C) U26.10(GND) U26.11(GND) U26.13(N/C) U26.14(N/C) U26.15(N/C) U26.16(N/C) U26.17(EP(GND))
CLK_SYNTH_8: C235.2 L6.1 ; port CLK_SYNTH_IN
CLK_SYNTH_LP: C228.2 D40.2(K2) D40.4(A4) R193.2 R195.2
DRS4_IN8_N: R186.2 R192.2 ; port DRS-
DRS4_IN8_P: R185.2 R191.2 ; port DRS+
HMC849:EN8: U26.5(EN) ; port SW0_EN
HMC849:VCTL8: U26.2(VCTL) ; port SW0_VCTL
IN+_OFS: L4.2 ; port IN+_OFS
IN-_OFS: L5.1 ; port IN-_OFS  [project net ~{IN}~{_OFS}]
TC_8: C229.2 ; port TC_SINUS_0
V_CM: C223.1 C226.1 OP2.4(CM) OP2.9(CM) ; port V_CM
NetC213_2: C213.2 C214.1 C215.2 C216.1 FB13.2 U26.1(VDD)
NetC217_1: C217.1 C219.1 C221.2 C224.2 FB14.2 OP2.5(VS+) OP2.6(VS+) OP2.7(VS+) OP2.8(VS+)
NetC218_1: C218.1 C220.1 C222.2 C225.2 FB15.2 OP2.13(VS-) OP2.14(VS-) OP2.15(VS-) OP2.16(VS-)
NetC227_2: C227.2 R183.2
NetC228_1: C228.1 U26.12(RF2)
NetC229_1: C229.1 U26.9(RF1)
NetC230_1: C230.1 R187.1 R188.2
NetC230_2: C230.2 U26.3(RFC)
NetC231_1: C231.1 R185.1
NetC231_2: C231.2 OP2.10(VOUT-) R190.2
NetC232_1: C232.1 R186.1
NetC232_2: C232.2 OP2.3(VOUT+) R189.2
NetC233_1: C233.1 L4.1 R191.1
NetC233_2: C233.2 L5.2 R192.1
NetC234_2: C234.2 L8.2 R193.1 R194.2
NetC236_2: C236.2 L6.2 L7.1
NetC237_2: C237.2 L7.2 L8.1
NetOP2_2: OP2.2(VIN-) R187.2 R189.1
NetOP2_11: OP2.11(VIN+) R184.2 R190.1
NetR182_1: R182.1 R183.1 R184.1

Not connected (* = marked no-connect by the designer): D40 3(C3)* 6(C6)*; OP2 1(NC)* 12(~{PD})*

### Layout directives
net class S50: (no net found under the mark), CLK_SYNTH_LP, NetC227_2, NetC228_1, NetC229_1, NetC230_1, NetC230_2, NetOP2_2, NetOP2_11, NetR182_1, TC_8
differential pair; differential pair class D100: DRS4_IN8_N, DRS4_IN8_P

### Notes on the sheet
- Decoupling capacitors for HMC849
- Remove Solder Mask for Analog FE
- Place decoupling caps within 2mm of supply pins
- No ground plane under outputs
- D100
- No ground plane under input pins
- (near R190) Short feedback path
- No vias
- Chebyshev 7th order ~430 mVpp 25MHz for DRS4 9th channel
- 475 Portola Plaza
- GAPS TOF
- igarcia91@g.ucla.edu
- Los Angeles, CA
- 310-825-0344
- Size:
- Date:
- Letter
- Revision:
- Time:
- Sheet
- of
- andrew.peck@cern.ch
- spq@ucla.edu
- File:
- (in symbol HMC849ALP4CE) 50

### Library data of the parts
C213 C215 C217-C220 C223 C226 C233 = Cap_Taiyo_Yuden_TMK105B7104KV-FR_100nF: CAP CER 100nF 25V X7R 0402; Supplier 1: Mouser; Supplier Part Number 1: 963-TMK105B7104KV-FR
C214 C216 = Cap_Wurth_Electronics_885012206075_470nF: CAP CER 470nF 25V X7R 0603; Supplier 1: Mouser; Supplier Part Number 1: 710-885012206075
C221 C222 C224 C225 = Cap_Murata_ GRM21BC71E106ME11L_10uF: CAP CER 10uF 25V X7R 0805; Supplier 1: Mouser; Supplier Part Number 1: 81-GRM21BC71E106ME1L
C227-C232 = Cap_TDK_C1608X5R1A106M080AC_220nF: CAP CER 220nF 50V X7R 0402; Supplier 1: Mouser; Supplier Part Number 1: 810-C1005X7R1E224KBE
C234 C235 = Cap_TDK_CGA2B2C0G2A151J050BE_150pF: CAP 150pF 50V C0G ±1% 0402 (1000 Metric) Thickness 1mm SMD; Supplier 1: Mouser; Supplier Part Number 1: 810-CGA2B2C0G2A151J0
C236 C237 = Cap_Murata_GCM1555C1H271FA16D_270pF: CAP 270pF 50V C0G ±1% 0402; Supplier 1: Mouser; Supplier Part Number 1: 81-GCM1555C1H271FA6D
D40 = CMP-1176-00030-1: Silicon Switching Diode, SOT363, Reel, Green; Manufacturer: Infineon; VR (max): 80Â V; VBR (min): 85Â V; IF (max): 200Â mA; trr (max): 4Â ns; Green: TRUE; VF (max): 1.25Â V; Configuration: Quadruple; IR (max): 150Â nA; PackageReference: SOT363; Halogen-free: TRUE; ComponentLink3URL: http://www.infineon.com/dgdl/SOT363-Package_Overview.pdf?folderId=db3a30431936bc4b01195360bd8f3cdc&fileId=db3a30431936bc4b0119536b62bf3cf5; PartNumber: BAV99S; ComponentLink3Description: Package Specification; ComponentLink2URL: http://www.infineon.com/dgdl/bav99series.pdf?folderId=db3a30431400ef6801141b5844e103ea&fileId=db3a30431400ef6801141c1b237d042f; ComponentLink1Description: Manufacturer URL; ComponentLink2Description: Datasheet; ComponentLink1URL: http://www.infineon.com/; PackageDescription: 6-Pin Small Outline Transistor Package, 1.25 x 2 mm Body; Mounting Technology: Surface Mount
FB13-FB15 = FB_Wurth_Electronics_742792731_100Ohms: as FB8 on sheet DRS4_ADC; Supplier 1: Mouser; Supplier Part Number 1: 710-742792731
L4 L5 = Ind_TDK_ MLG1005SR22JT000_220nH: Fixed Inductors .22 UH 5%; Supplier 1: Mouser; Supplier Part Number 1: 810-MLG1005SR22JT000
L6 L8 = Ind_TDK_MLF1005GR47JT000: IND 470nH Shielded Multilayer Inductor 50mA 420 mOhm Max 0402 (1005 Metric); Manufacturer: TDK; Value: 270.0nH; DC Resistance (DCR): 420mOhms; Part Number: MLF1005GR47JT000; ComponentLink2Description: Datasheet; Temperature: -55°C to +125°C; ComponentLink2URL: https://product.tdk.com/info/en/catalog/datasheets/inductor_commercial_decoupling_mlz1608_en.pdf; RoHS: TRUE; Temperature Range High: +125°C; Lead Free: yes; Temperature Range Low: -55°C; Tolerance: ±5%; Package: 0402 (1005); Inductance: 470nH; Supplier 1: Mouser; Supplier Part Number 1: 810-MLF1005GR47JT000
L7 = Ind_TDK_MHQ1005PR51GT000: IND 510nH Shielded Multilayer Inductor 70mA 10.2 Ohm Max 0402 (1005 Metric); Manufacturer: TDK; Value: 510.0nH; DC Resistance (DCR): 10.2Ohms; Part Number: MHQ1005PR51GT000; ComponentLink2Description: Datasheet; Temperature: -55°C to +125°C; ComponentLink2URL: https://product.tdk.com/info/en/catalog/datasheets/inductor_commercial_decoupling_mlz1608_en.pdf; RoHS: TRUE; Temperature Range High: +125°C; Lead Free: yes; Temperature Range Low: -55°C; Tolerance: ±2%; Package: 0402 (1005); Inductance: 510nH; Supplier Part Number 1: 810-MHQ1005PR51GT000; Supplier 1: Mouser
OP2 = THS4509RGTT: Differential Amplifier 1 Circuit Differential 16-QFN (3x3); Vendor: Texas Instruments; Built_By: EMA_UL_Team; C: Copyright (C) 2015 Accelerated Designs. All rights reserved; Manufacturer_Part_Number: THS4509RGTT; RefDes: RefDes; Type: DEV; Value: Value; Supplier 1: Mouser; Supplier Part Number 1: 595-THS4509RGTT
R182 R188 = CMP-1011-00374-1: 61R9 0.063W 1% 0402 (1005 Metric)  SMD; Value: 61.90 Ohm; Case-EIA: 0402; Case-Metric: 1005; Tolerance: 1 %; Technology: SMT; Power: 0.063 W
R183 = CMP-1011-00363-1: 49R9 0.063W 1% 0402 (1005 Metric)  SMD; Case-EIA: 0402; Case-Metric: 1005; Value: 49.90 Ohm; Power: 0.063 W; Technology: SMT; Tolerance: 1 %
R184 R187 = CMP-1011-00420-1: 165R 0.063W 1% 0402 (1005 Metric)  SMD; Case-EIA: 0402; Case-Metric: 1005; Value: 165.00 Ohm; Power: 0.063 W; Technology: SMT; Tolerance: 1 %
R185 R186 = CMP-1011-00302-1: 15R 0.063W 1% 0402 (1005 Metric)  SMD; Case-Metric: 1005; Case-EIA: 0402; Value: 15.00 Ohm; Tolerance: 1 %; Power: 0.063 W; Technology: SMT
R189 R190 = CMP-1011-00457-1: 348R 0.063W 1% 0402 (1005 Metric)  SMD; Case-EIA: 0402; Value: 348.00 Ohm; Case-Metric: 1005; Tolerance: 1 %; Technology: SMT; Power: 0.063 W
R191 R192 = CMP-1011-00320-1: as R140 on sheet DRS4_ADC; Tolerance: 1 %; Technology: SMT; Power: 0.063 W
R193 = CMP-1011-00311-1: 18R 0.063W 1% 0402 (1005 Metric)  SMD; Case-EIA: 0402; Value: 18.00 Ohm; Case-Metric: 1005; Tolerance: 1 %; Power: 0.063 W; Technology: SMT
R194 R195 = CMP-1011-00449-1: 300R 0.063W 1% 0402 (1005 Metric)  SMD; Case-EIA: 0402; Value: 300.00 Ohm; Case-Metric: 1005; Tolerance: 1 %; Technology: SMT; Power: 0.063 W
U26 = HMC849ALP4CE: RF Switch ICs DC-6 GHZ Hi Isolation Switch; Vendor: Analog Devices Inc; Built_By: Analog Devices Imc.; Manufacturer_Part_Number: HMC849ALP4CE; RefDes: RefDes; Type: DEV; Supplier 1: Mouser; Supplier Part Number 1: 584-HMC849ALP4CE; Series: HMC849ALP4CE

## Sheet MarsCarrier.SchDoc: My title
size A3; Organization: University of California; Address1: 475 Portola Plaza; Address2: Los Angeles, CA 90095; DocumentNumber: 19; Revision: R01; SheetNumber: 19; SheetTotal: 35
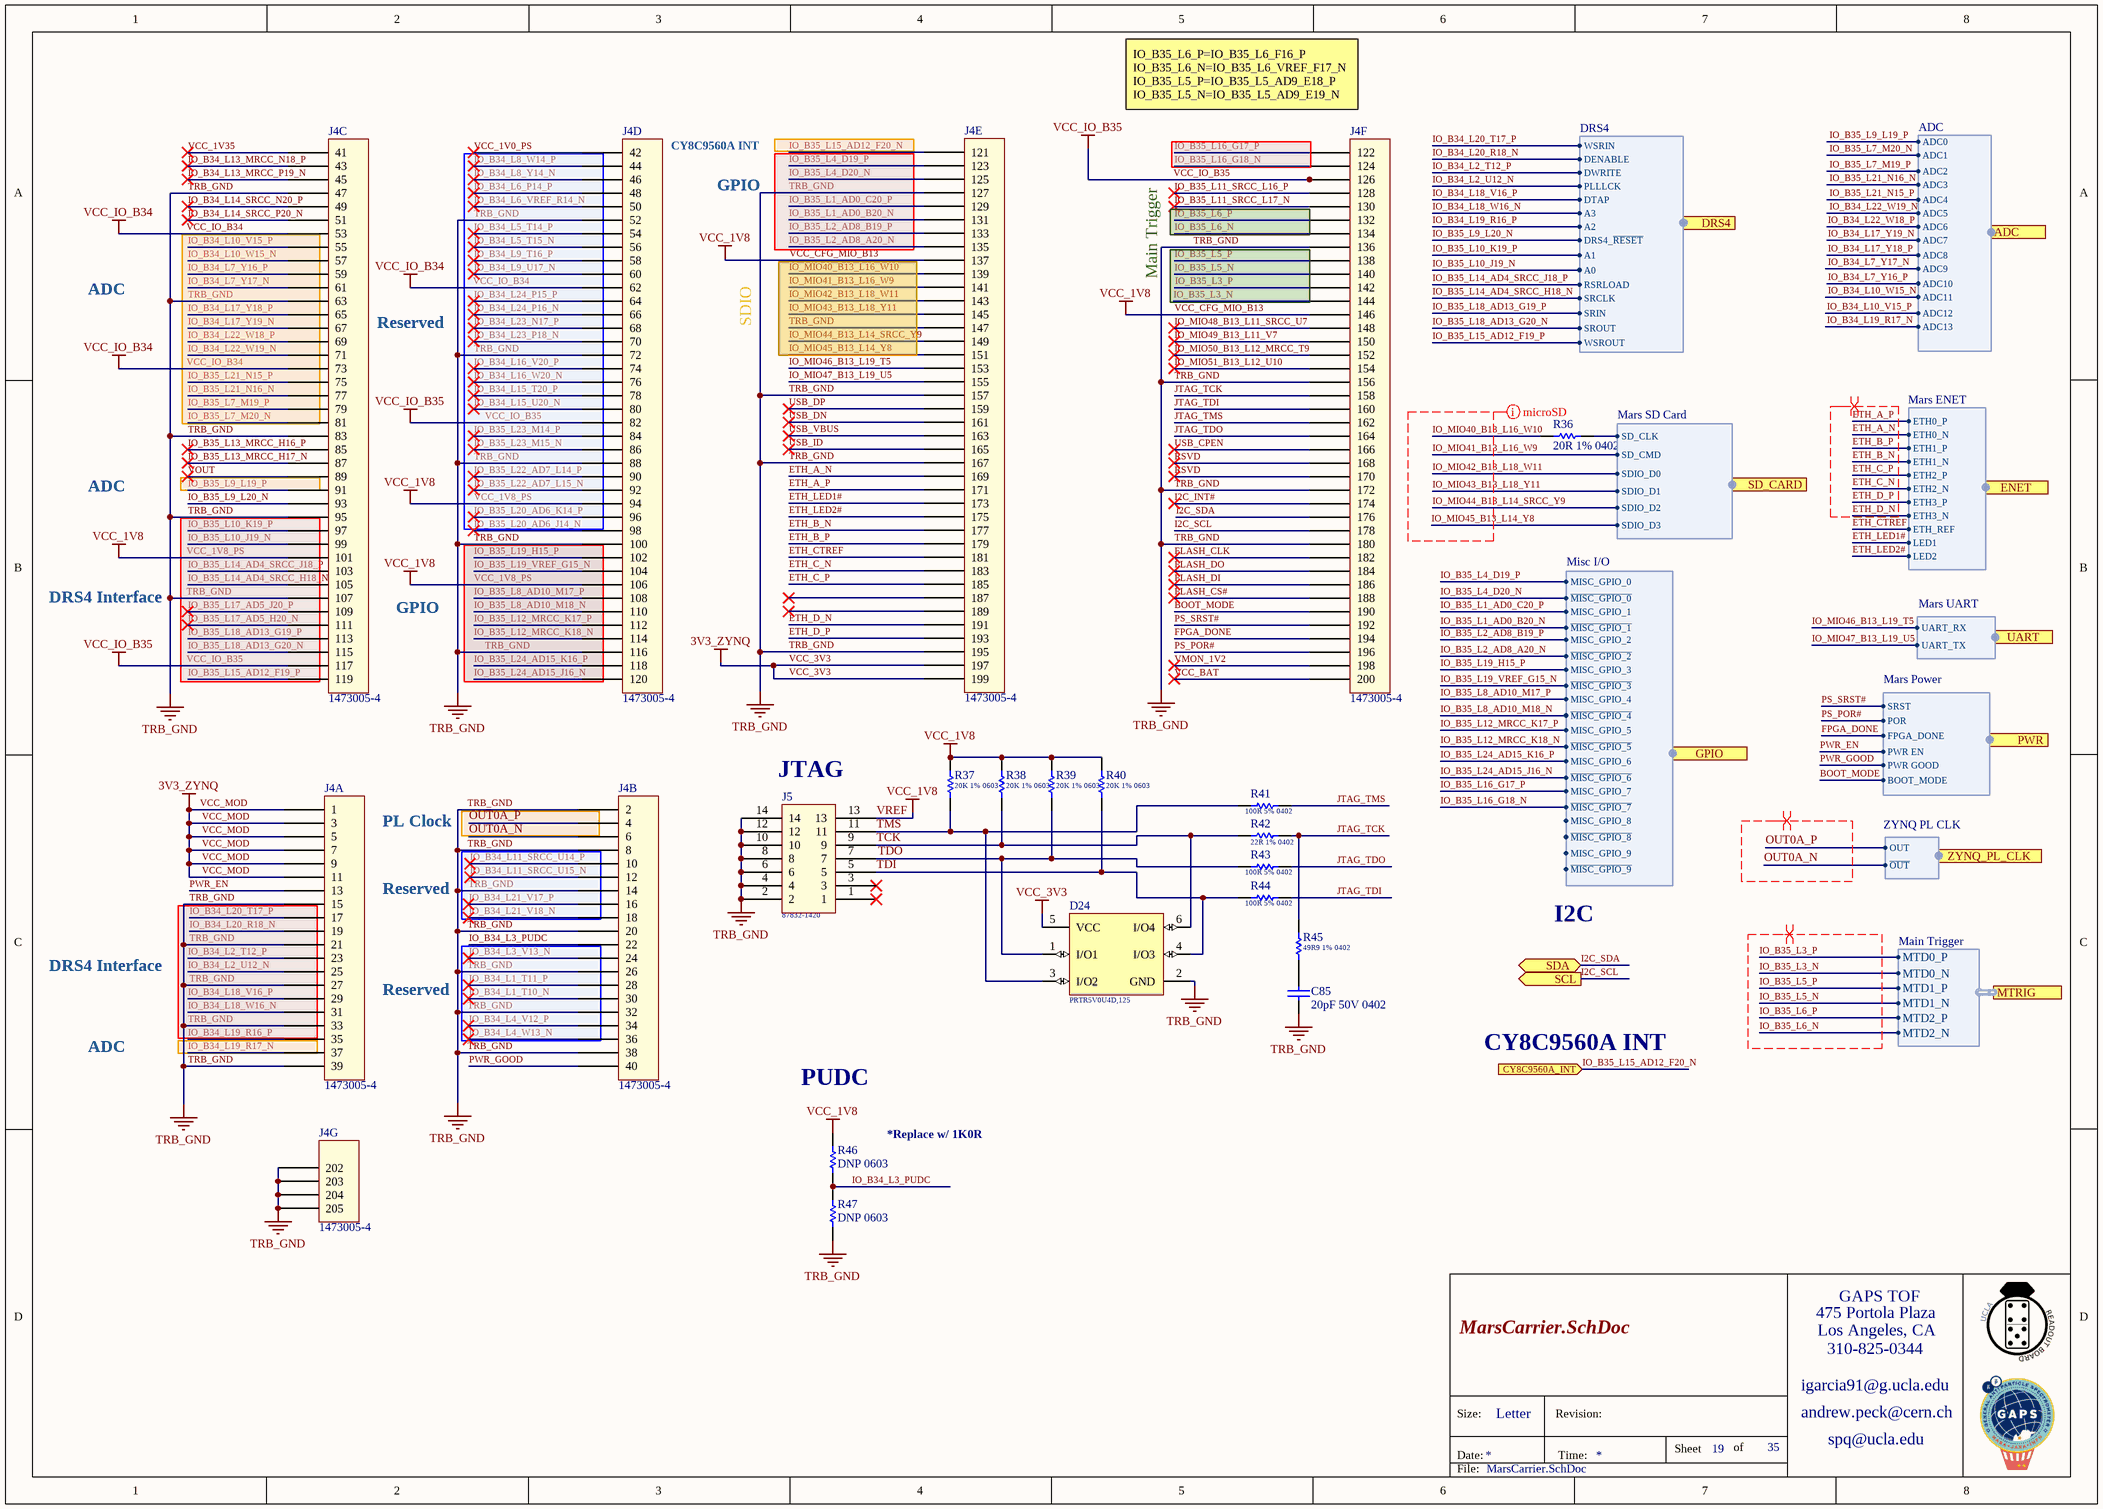
[diagram p6: MarsCarrier.SchDoc]

### Parts
C85  Capacitance: 20pF 50V 0402  [Cap_Murata_GJM1555C1H200GB01D_20pF]  (hidden comment: Cap_Murata_GJM1555C1H200GB01D_20pF)
D24  PRTR5V0U4D,125  [PRTR5V0U4D,125]
J4  Series: 1473005-4  [DIMM_TE_Connectivity_1473005-4_200POS]  (hidden comment: DIMM_TE_Connectivity_1473005-4_200POS)  (parts A,B,C,D,E,F,G of 7)
J5  Series: 87832-1420  [Header_Molex_87832-1420_14POS]  (hidden comment: Header_Molex_87832-1420_14POS)
R36  Resistance: 20R 1% 0402  [Res_ROHM_SFR01MZPF20R0_20_Ohm]  (hidden comment: Res_ROHM_SFR01MZPF20R0_20_Ohm)
R37  20K 1% 0603  [RESC0603(1608)_L]
R38  20K 1% 0603  [RESC0603(1608)_L]
R39  20K 1% 0603  [RESC0603(1608)_L]
R40  20K 1% 0603  [RESC0603(1608)_L]
R41  100R 5% 0402  [RESC0402(1005)_L]
R42  22R 1% 0402  [RESC0402(1005)_L]
R43  100R 5% 0402  [RESC0402(1005)_L]
R44  100R 5% 0402  [RESC0402(1005)_L]
R45  49R9 1% 0402  [RESC0402(1005)_L]
R46  Resistance: DNP 0603  [RES_DNP_0603]  (hidden comment: RES_DNP_0603)
R47  Resistance: DNP 0603  [RES_DNP_0603]  (hidden comment: RES_DNP_0603)

### Ports
ADC (harness ADC), CY8C9560A_INT (in), DRS4 (harness DRS4), ENET (harness Mars ENET), GPIO (harness Misc I/O), MTRIG (harness Main Trigger), PWR (harness Mars Power), SCL (out), SD_CARD (harness Mars SD Card), SDA (bidir), UART (harness Mars UART), ZYNQ_PL_CLK (harness ZYNQ PL CLK)

### Harnesses
Mars SD Card: SDIO_D2, SDIO_D1, SDIO_D0, SD_CMD, SD_CLK, SDIO_D3
Mars UART: UART_RX, UART_TX
ADC: ADC0, ADC1, ADC2, ADC3, ADC4, ADC5, ADC6, ADC7, ADC8, ADC9, ADC10, ADC11, ADC12, ADC13
Mars ENET: ETH0_P, ETH0_N, ETH1_P, ETH1_N, ETH2_P, ETH2_N, ETH3_P, ETH3_N, ETH_REF, LED1, LED2
Mars Power: PWR GOOD, PWR EN, FPGA_DONE, SRST, POR, BOOT_MODE
ZYNQ PL CLK: OUT, ~{OUT}
Misc I/O: MISC_GPIO_0, ~{MISC_GPIO_0}, MISC_GPIO_1, ~{MISC_GPIO_1}, MISC_GPIO_2, ~{MISC_GPIO_2}, MISC_GPIO_3, ~{MISC_GPIO_3}, MISC_GPIO_4, ~{MISC_GPIO_4}, MISC_GPIO_5, ~{MISC_GPIO_5}, MISC_GPIO_6, ~{MISC_GPIO_6}, MISC_GPIO_7, ~{MISC_GPIO_7}, MISC_GPIO_8, ~{MISC_GPIO_8}, MISC_GPIO_9, ~{MISC_GPIO_9}
DRS4: A3, A2, A1, A0, DTAP, SROUT, SRCLK, SRIN, RSRLOAD, WSROUT, DWRITE, PLLLCK, WSRIN, DENABLE, DRS4_~{RESET}
Main Trigger: MTD0_P, MTD0_N, MTD1_P, MTD1_N, MTD2_P, MTD2_N

### Nets
TRB_GND: C85.1 D24.2(GND) J4.2 J4.8 J4.14 J4.15 J4.20 J4.21 J4.26 J4.27 J4.32 J4.33 J4.38 J4.39 J4.47 J4.52 J4.63 J4.72 J4.83 J4.88 J4.95 J4.100 J4.107 J4.116 J4.127 J4.136 J4.147 J4.156 J4.157 J4.167 J4.172 J4.180 J4.195 J4.202 J4.203 J4.204 J4.205 J5.2 J5.4 J5.6 J5.8 J5.10 J5.12 J5.14 R47.2
VCC_1V8_PS: J4.94 J4.101 J4.106 J4.137 J4.146 J5.13 R37.2 R38.2 R39.2 R40.2 R46.1  [also labelled VCC_1V8, VCC_CFG_MIO_B13, VREF]
VCC_3V3: D24.5(VCC) J4.1 J4.3 J4.5 J4.7 J4.9 J4.11 J4.197 J4.199  [also labelled 3V3_ZYNQ, VCC_MOD]
VCC_IO_B34: J4.53 J4.62 J4.73 J4.82 J4.117 J4.126  [also labelled VCC_IO_B35]
BOOT_MODE: J4.190 ; port PWR.BOOT_MODE
ETH_A_N: J4.169 ; port ENET.ETH0_N
ETH_A_P: J4.171 ; port ENET.ETH0_P
ETH_B_N: J4.177 ; port ENET.ETH1_N
ETH_B_P: J4.179 ; port ENET.ETH1_P
ETH_C_N: J4.183 ; port ENET.ETH2_N
ETH_C_P: J4.185 ; port ENET.ETH2_P
ETH_CTREF: J4.181 ; port ENET.ETH_REF
ETH_D_N: J4.191 ; port ENET.ETH3_N
ETH_D_P: J4.193 ; port ENET.ETH3_P
ETH_LED1#: J4.173 ; port ENET.LED1
ETH_LED2#: J4.175 ; port ENET.LED2
FLASH_CLK: J4.182
FLASH_CS#: J4.188
FLASH_DI: J4.186
FLASH_DO: J4.184
FPGA_DONE: J4.194 ; port PWR.FPGA_DONE
I2C_INT#: J4.174
I2C_SCL: J4.178 ; port SCL
I2C_SDA: J4.176 ; port SDA
IO_B34_L1_T10_N: J4.30
IO_B34_L1_T11_P: J4.28
IO_B34_L2_T12_P: J4.23 ; port DRS4.DWRITE  [project net DRS4_DWRITE]
IO_B34_L2_U12_N: J4.25 ; port DRS4.PLLLCK  [project net DRS4_PLLLCK]
IO_B34_L3_PUDC: J4.22 R46.2 R47.1
IO_B34_L3_V13_N: J4.24
IO_B34_L4_V12_P: J4.34
IO_B34_L4_W13_N: J4.36
IO_B34_L5_T14_P: J4.54
IO_B34_L5_T15_N: J4.56
IO_B34_L6_P14_P: J4.48
IO_B34_L6_VREF_R14_N: J4.50
IO_B34_L7_Y16_P: J4.59 ; port ADC.ADC10
IO_B34_L7_Y17_N: J4.61 ; port ADC.ADC9
IO_B34_L8_W14_P: J4.44
IO_B34_L8_Y14_N: J4.46
IO_B34_L9_T16_P: J4.58
IO_B34_L9_U17_N: J4.60
IO_B34_L10_V15_P: J4.55 ; port ADC.ADC12
IO_B34_L10_W15_N: J4.57 ; port ADC.ADC11
IO_B34_L11_SRCC_U14_P: J4.10
IO_B34_L11_SRCC_U15_N: J4.12
IO_B34_L13_MRCC_N18_P: J4.43
IO_B34_L13_MRCC_P19_N: J4.45
IO_B34_L14_SRCC_N20_P: J4.49
IO_B34_L14_SRCC_P20_N: J4.51
IO_B34_L15_T20_P: J4.78
IO_B34_L15_U20_N: J4.80
IO_B34_L16_V20_P: J4.74
IO_B34_L16_W20_N: J4.76
IO_B34_L17_Y18_P: J4.65 ; port ADC.ADC8
IO_B34_L17_Y19_N: J4.67 ; port ADC.ADC7
IO_B34_L18_V16_P: J4.29 ; port DRS4.DTAP  [project net DRS4_DTAP]
IO_B34_L18_W16_N: J4.31 ; port DRS4.A3  [project net DRS4_A3]
IO_B34_L19_R16_P: J4.35 ; port DRS4.A2  [project net DRS4_A2]
IO_B34_L19_R17_N: J4.37 ; port ADC.ADC13
IO_B34_L20_R18_N: J4.19 ; port DRS4.DENABLE  [project net DRS4_DENABLE]
IO_B34_L20_T17_P: J4.17 ; port DRS4.WSRIN  [project net DRS4_WSRIN]
IO_B34_L21_V17_P: J4.16
IO_B34_L21_V18_N: J4.18
IO_B34_L22_W18_P: J4.69 ; port ADC.ADC6
IO_B34_L22_W19_N: J4.71 ; port ADC.ADC5
IO_B34_L23_N17_P: J4.68
IO_B34_L23_P18_N: J4.70
IO_B34_L24_P15_P: J4.64
IO_B34_L24_P16_N: J4.66
IO_B35_L1_AD0_B20_N: J4.131 ; port GPIO.~{MISC_GPIO_1}  [project net GPIO1_N]
IO_B35_L1_AD0_C20_P: J4.129 ; port GPIO.MISC_GPIO_1  [project net GPIO1_P]
IO_B35_L2_AD8_A20_N: J4.135 ; port GPIO.~{MISC_GPIO_2}  [project net GPIO2_N]
IO_B35_L2_AD8_B19_P: J4.133 ; port GPIO.MISC_GPIO_2  [project net GPIO2_P]
IO_B35_L3_N: J4.144 ; port MTRIG.MTD0_N
IO_B35_L3_P: J4.142 ; port MTRIG.MTD0_P
IO_B35_L4_D19_P: J4.123 ; port GPIO.MISC_GPIO_0  [project net GPIO0_P]
IO_B35_L4_D20_N: J4.125 ; port GPIO.~{MISC_GPIO_0}  [project net GPIO0_N]
IO_B35_L5_N: J4.140 ; port MTRIG.MTD1_N
IO_B35_L5_P: J4.138 ; port MTRIG.MTD1_P
IO_B35_L6_N: J4.134 ; port MTRIG.MTD2_N
IO_B35_L6_P: J4.132 ; port MTRIG.MTD2_P
IO_B35_L7_M19_P: J4.79 ; port ADC.ADC2
IO_B35_L7_M20_N: J4.81 ; port ADC.ADC1
IO_B35_L8_AD10_M17_P: J4.108 ; port GPIO.MISC_GPIO_4  [project net GPIO4_P]
IO_B35_L8_AD10_M18_N: J4.110 ; port GPIO.~{MISC_GPIO_4}  [project net GPIO4_N]
IO_B35_L9_L19_P: J4.91 ; port ADC.ADC0
IO_B35_L9_L20_N: J4.93 ; port DRS4.DRS4_~{RESET}  [project net DRS4~{_RESET}]
IO_B35_L10_J19_N: J4.99 ; port DRS4.A0  [project net DRS4_A0]
IO_B35_L10_K19_P: J4.97 ; port DRS4.A1  [project net DRS4_A1]
IO_B35_L11_SRCC_L16_P: J4.128
IO_B35_L11_SRCC_L17_N: J4.130
IO_B35_L12_MRCC_K17_P: J4.112 ; port GPIO.MISC_GPIO_5  [project net GPIO5_P]
IO_B35_L12_MRCC_K18_N: J4.114 ; port GPIO.~{MISC_GPIO_5}  [project net GPIO5_N]
IO_B35_L13_MRCC_H16_P: J4.85
IO_B35_L13_MRCC_H17_N: J4.87
IO_B35_L14_AD4_SRCC_H18_N: J4.105 ; port DRS4.SRCLK  [project net DRS4_SRCLK]
IO_B35_L14_AD4_SRCC_J18_P: J4.103 ; port DRS4.RSRLOAD  [project net DRS4_RSRLOAD]
IO_B35_L15_AD12_F19_P: J4.119 ; port DRS4.WSROUT  [project net DRS4_WSROUT]
IO_B35_L15_AD12_F20_N: J4.121 ; port CY8C9560A_INT
IO_B35_L16_G17_P: J4.122 ; port GPIO.MISC_GPIO_7  [project net GPIO7_P]
IO_B35_L16_G18_N: J4.124 ; port GPIO.~{MISC_GPIO_7}  [project net GPIO7_N]
IO_B35_L17_AD5_H20_N: J4.111
IO_B35_L17_AD5_J20_P: J4.109
IO_B35_L18_AD13_G19_P: J4.113 ; port DRS4.SRIN  [project net DRS4_SRIN]
IO_B35_L18_AD13_G20_N: J4.115 ; port DRS4.SROUT  [project net DRS4_SROUT]
IO_B35_L19_H15_P: J4.102 ; port GPIO.MISC_GPIO_3  [project net GPIO3_P]
IO_B35_L19_VREF_G15_N: J4.104 ; port GPIO.~{MISC_GPIO_3}  [project net GPIO3_N]
IO_B35_L20_AD6_J14_N: J4.98
IO_B35_L20_AD6_K14_P: J4.96
IO_B35_L21_N15_P: J4.75 ; port ADC.ADC4
IO_B35_L21_N16_N: J4.77 ; port ADC.ADC3
IO_B35_L22_AD7_L14_P: J4.90
IO_B35_L22_AD7_L15_N: J4.92
IO_B35_L23_M14_P: J4.84
IO_B35_L23_M15_N: J4.86
IO_B35_L24_AD15_J16_N: J4.120 ; port GPIO.~{MISC_GPIO_6}  [project net GPIO6_N]
IO_B35_L24_AD15_K16_P: J4.118 ; port GPIO.MISC_GPIO_6  [project net GPIO6_P]
IO_MIO40_B13_L16_W10: J4.139 R36.1
IO_MIO41_B13_L16_W9: J4.141 ; port SD_CARD.SD_CMD
IO_MIO42_B13_L18_W11: J4.143 ; port SD_CARD.SDIO_D0
IO_MIO43_B13_L18_Y11: J4.145 ; port SD_CARD.SDIO_D1
IO_MIO44_B13_L14_SRCC_Y9: J4.149 ; port SD_CARD.SDIO_D2
IO_MIO45_B13_L14_Y8: J4.151 ; port SD_CARD.SDIO_D3
IO_MIO46_B13_L19_T5: J4.153 ; port UART.UART_RX
IO_MIO47_B13_L19_U5: J4.155 ; port UART.UART_TX
IO_MIO48_B13_L11_SRCC_U7: J4.148
IO_MIO49_B13_L11_V7: J4.150
IO_MIO50_B13_L12_MRCC_T9: J4.152
IO_MIO51_B13_L12_U10: J4.154
JTAG_TCK: J4.158 R42.1 R45.1
JTAG_TDI: J4.160 R44.1
JTAG_TDO: J4.164 R43.1
JTAG_TMS: J4.162 R41.1
OUT0A_N: J4.6 ; port ZYNQ_PL_CLK.~{OUT}
OUT0A_P: J4.4 ; port ZYNQ_PL_CLK.OUT
PS_POR#: J4.196 ; port PWR.POR  [project net POR]
PS_SRST#: J4.192 ; port PWR.SRST
PWR_EN: J4.13 ; port PWR.PWR EN  [project net POWER_EN]
PWR_GOOD: J4.40 ; port PWR.PWR GOOD  [project net POWER_GOOD]
RSVD: J4.168 J4.170
SDIO_CLK: R36.2 ; port SD_CARD.SD_CLK
TCK: D24.6(I/O4) J5.9 R38.1 R42.2
TDI: D24.4(I/O3) J5.5 R40.1 R44.2
TDO: D24.1(I/O1) J5.7 R39.1 R43.2
TMS: D24.3(I/O2) J5.11 R37.1 R41.2
USB_CPEN: J4.166
USB_DN: J4.161
USB_DP: J4.159
USB_ID: J4.165
USB_VBUS: J4.163
VCC_1V0_PS: J4.42
VCC_1V35: J4.41
VCC_BAT: J4.200
VMON_1V2: J4.198
VOUT: J4.89
NetC85_2: C85.2 R45.2

Not connected (* = marked no-connect by the designer): J4 187* 189*; J5 1* 3*

### Layout directives
net class S50; rule Matched Net Lengths [Tolerance = 100mil]: IO_MIO40_B13_L16_W10, IO_MIO41_B13_L16_W9, IO_MIO42_B13_L18_W11, IO_MIO43_B13_L18_Y11, IO_MIO44_B13_L14_SRCC_Y9, IO_MIO45_B13_L14_Y8
differential pair; rule Differential Pairs Routing [Pref Gap = 10mil    Min Gap  = 5mil    Max Gap  = 10milPref Width = 15mil    Min Width  = 3.244mil    Max Width  = 15mil]; differential pair class D100; rule Matched Net Lengths [Tolerance = 100mil]: IO_B35_L3_N, IO_B35_L3_P, IO_B35_L5_N, IO_B35_L5_P, IO_B35_L6_N, IO_B35_L6_P
differential pair; differential pair class D100: OUT0A_N, OUT0A_P
differential pair; differential pair class D100; rule Differential Pairs Routing [Pref Gap = 10mil    Min Gap  = 5mil    Max Gap  = 10milPref Width = 15mil    Min Width  = 3.244mil    Max Width  = 15mil]: ETH_A_N, ETH_A_P, ETH_B_N, ETH_B_P, ETH_C_N, ETH_C_P, ETH_D_N, ETH_D_P

### Notes on the sheet
- (near J4) IO_B35_L6_P=IO_B35_L6_F16_P IO_B35_L6_N=IO_B35_L6_VREF_F17_N IO_B35_L5_P=IO_B35_L5_AD9_E18_P IO_B35_L5_N=IO_B35_L5_AD9_E19_N
- (near J4) CY8C9560A INT
- GPIO
- ADC
- Main Trigger
- (near J4) Reserved
- SDIO
- DRS4 Interface
- (near J5) JTAG
- PL Clock
- Reserved
- I2C
- CY8C9560A INT
- PUDC
- *Replace w/ 1K0R
- 475 Portola Plaza
- GAPS TOF
- igarcia91@g.ucla.edu
- Los Angeles, CA
- 310-825-0344
- Size:
- Date:
- Letter
- Revision:
- Time:
- Sheet
- of
- andrew.peck@cern.ch
- spq@ucla.edu
- File:

### Library data of the parts
C85 = Cap_Murata_GJM1555C1H200GB01D_20pF: as C159-C161 on sheet DRS4_ADC; Supplier 1: Mouser; Supplier Part Number 1: 81-GJM1555C1H200GB01
D24 = PRTR5V0U4D,125: ESD Suppressors / TVS Diodes 5.5V QUAD R-R ESD ULTRA LOW CAP; Supplier 1: Mouser; Supplier Part Number 1: 771-PRTR5V0U4D-T/R
J4 = DIMM_TE_Connectivity_1473005-4_200POS: DIMM Connectors DDR2 SODIMM 200P STANDARD HOUSING; Supplier 1: Mouser; Supplier Part Number 1: 571-1473005-4
J5 = Header_Molex_87832-1420_14POS: Headers & Wire Housings 14P SMD PB FREE SHRD; Supplier Part Number 1: 538-87832-1420; Supplier 1: Mouser
R36 = Res_ROHM_SFR01MZPF20R0_20_Ohm: 20R 62.5mW 1% 0402 (1005 Metric)  SMD; Supplier 1: Mouser; Supplier Part Number 1: 755-SFR01MZPF20R0
R37-R40 = CMP-1012-00655-1: 20K 0.1W 1% 0603 (1608 Metric)  SMD; Case-Metric: 1608; Case-EIA: 0603; Value: 20000.00 Ohm; Technology: SMT; Tolerance: 1 %; Power: 0.1 W
R41 R43 R44 = CMP-1011-00050-1: 100R 0.063W 5% 0402 (1005 Metric)  SMD; Case-EIA: 0402; Value: 100.00 Ohm; Case-Metric: 1005; Tolerance: 5 %; Technology: SMT; Power: 0.063 W
R42 = CMP-1011-00320-1: as R140 on sheet DRS4_ADC; Tolerance: 1 %; Technology: SMT; Power: 0.063 W
R45 = CMP-1011-00363-1: as R183 on sheet ANA_FE_CLK_SYNTH; Power: 0.063 W; Technology: SMT; Tolerance: 1 %
R46 R47 = RES_DNP_0603: 0603 Do not place resistor

## Sheet ENET.SchDoc: My title
size A3; Organization: University of California; Address1: 475 Portola Plaza; Address2: Los Angeles, CA 90095; DocumentNumber: 15; Revision: R01; SheetNumber: 15; SheetTotal: 35
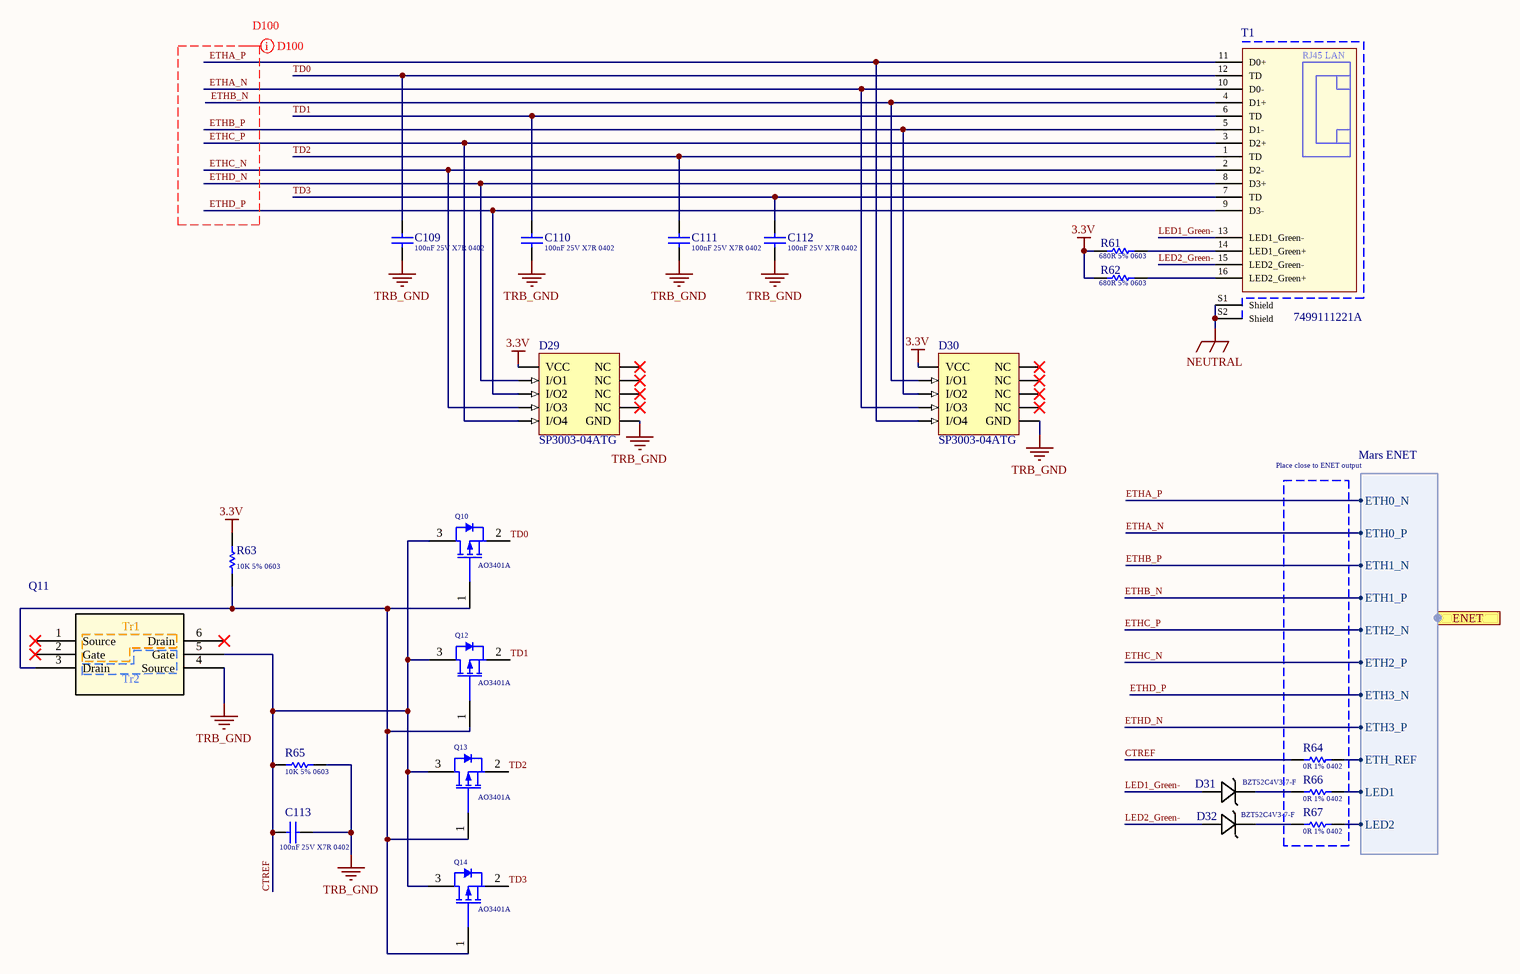
[diagram p7: ENET.SchDoc]

### Parts
C109  Capacitance: 100nF 25V X7R 0402  [Cap_Taiyo_Yuden_TMK105B7104KV-FR_100nF]  (hidden comment: Cap_Taiyo_Yuden_TMK105B7104KV-FR_100nF)
C110  Capacitance: 100nF 25V X7R 0402  [Cap_Taiyo_Yuden_TMK105B7104KV-FR_100nF]  (hidden comment: Cap_Taiyo_Yuden_TMK105B7104KV-FR_100nF)
C111  Capacitance: 100nF 25V X7R 0402  [Cap_Taiyo_Yuden_TMK105B7104KV-FR_100nF]  (hidden comment: Cap_Taiyo_Yuden_TMK105B7104KV-FR_100nF)
C112  Capacitance: 100nF 25V X7R 0402  [Cap_Taiyo_Yuden_TMK105B7104KV-FR_100nF]  (hidden comment: Cap_Taiyo_Yuden_TMK105B7104KV-FR_100nF)
C113  Capacitance: 100nF 25V X7R 0402  [Cap_Taiyo_Yuden_TMK105B7104KV-FR_100nF]  (hidden comment: Cap_Taiyo_Yuden_TMK105B7104KV-FR_100nF)
D29  Series: SP3003-04ATG  [Diode_SP3003-04ATG_LVDS_ESD]  (hidden comment: Diode_SP3003-04ATG_LVDS_ESD)
D30  Series: SP3003-04ATG  [Diode_SP3003-04ATG_LVDS_ESD]  (hidden comment: Diode_SP3003-04ATG_LVDS_ESD)
D31  BZT52C4V3-7-F  [SOD123]
D32  BZT52C4V3-7-F  [SOD123]
Q10  Series: AO3401A  [Mos_Alpha&Omega_AO3401A_4A]  (hidden comment: Mos_Alpha&Omega_AO3401A_4A)
Q11  EM6K6T2R  [TRANS_EM6_ROM]  (value not drawn)
Q12  Series: AO3401A  [Mos_Alpha&Omega_AO3401A_4A]  (hidden comment: Mos_Alpha&Omega_AO3401A_4A)
Q13  Series: AO3401A  [Mos_Alpha&Omega_AO3401A_4A]  (hidden comment: Mos_Alpha&Omega_AO3401A_4A)
Q14  Series: AO3401A  [Mos_Alpha&Omega_AO3401A_4A]  (hidden comment: Mos_Alpha&Omega_AO3401A_4A)
R61  680R 5% 0603  [RESC0603(1608)_L]
R62  680R 5% 0603  [RESC0603(1608)_L]
R63  10K 5% 0603  [RESC0603(1608)_L]
R64  Resistance: 0R 1% 0402  [Res_Vishay_CRCW04020000Z0EDC_0_Ohm]  (hidden comment: Res_Vishay_CRCW04020000Z0EDC_0_Ohm)
R65  10K 5% 0603  [RESC0603(1608)_L]
R66  Resistance: 0R 1% 0402  [Res_Vishay_CRCW04020000Z0EDC_0_Ohm]  (hidden comment: Res_Vishay_CRCW04020000Z0EDC_0_Ohm)
R67  Resistance: 0R 1% 0402  [Res_Vishay_CRCW04020000Z0EDC_0_Ohm]  (hidden comment: Res_Vishay_CRCW04020000Z0EDC_0_Ohm)
T1  7499111221A  [7499111221A]

### Ports
ENET (harness Mars ENET)

### Harnesses
Mars ENET: ETH0_P, ETH0_N, ETH1_P, ETH1_N, ETH2_P, ETH2_N, ETH3_P, ETH3_N, ETH_REF, LED1, LED2

### Nets
3.3V: D29.3(VCC) D30.3(VCC) R61.1 R62.1 R63.2
NEUTRAL: T1.S1(Shield) T1.S2(Shield)
TRB_GND: C109.1 C110.1 C111.1 C112.1 C113.1 D29.8(GND) D30.8(GND) Q11.4(Source) R65.1
CTREF: C113.2 Q10.3(D) Q11.5(Gate) Q12.3(D) Q13.3(D) Q14.3(D) R64.1 R65.2
ETH_CTREF: R64.2 ; port ENET.ETH_REF
ETH_LED1#: R66.2 ; port ENET.LED1
ETH_LED2#: R67.2 ; port ENET.LED2
ETHA_N: D30.4(I/O3) T1.10(D0-) ; port ENET.ETH0_P  [project net ETH_A_P]
ETHA_P: D30.5(I/O4) T1.11(D0+) ; port ENET.ETH0_N  [project net ETH_A_N]
ETHB_N: D30.1(I/O1) T1.4(D1+) ; port ENET.ETH1_P  [project net ETH_B_P]
ETHB_P: D30.2(I/O2) T1.5(D1-) ; port ENET.ETH1_N  [project net ETH_B_N]
ETHC_N: D29.4(I/O3) T1.2(D2-) ; port ENET.ETH2_P  [project net ETH_C_P]
ETHC_P: D29.5(I/O4) T1.3(D2+) ; port ENET.ETH2_N  [project net ETH_C_N]
ETHD_N: D29.1(I/O1) T1.8(D3+) ; port ENET.ETH3_P  [project net ETH_D_P]
ETHD_P: D29.2(I/O2) T1.9(D3-) ; port ENET.ETH3_N  [project net ETH_D_N]
LED1_Green-: D31.2 T1.13(LED1_Green-)
LED2_Green-: D32.2 T1.15(LED2_Green-)
TD0: C109.2 Q10.2(S) T1.12(TD)
TD1: C110.2 Q12.2(S) T1.6(TD)
TD2: C111.2 Q13.2(S) T1.1(TD)
TD3: C112.2 Q14.2(S) T1.7(TD)
NetD31_1: D31.1 R66.1
NetD32_1: D32.1 R67.1
NetQ10_1: Q10.1(G) Q11.3(Drain) Q12.1(G) Q13.1(G) Q14.1(G) R63.1
NetR61_2: R61.2 T1.14(LED1_Green+)
NetR62_2: R62.2 T1.16(LED2_Green+)

Not connected (* = marked no-connect by the designer): D29 6(NC)* 7(NC)* 9(NC)* 10(NC)*; D30 6(NC)* 7(NC)* 9(NC)* 10(NC)*; Q11 1(Source)* 2(Gate)* 6(Drain)*

### Layout directives
differential pair; differential pair class D100; rule Differential Pairs Routing [Pref Gap = 10mil    Min Gap  = 5mil    Max Gap  = 10milPref Width = 15mil    Min Width  = 3.244mil    Max Width  = 15mil]: ETHA_N, ETHA_P, ETHB_N, ETHB_P, ETHC_N, ETHC_P, ETHD_N, ETHD_P

### Notes on the sheet
- D100
- Place close to ENET output
- 475 Portola Plaza
- GAPS TOF
- igarcia91@g.ucla.edu
- Los Angeles, CA
- 310-825-0344
- Size:
- Date:
- Letter
- Revision:
- Time:
- Sheet
- of
- andrew.peck@cern.ch
- spq@ucla.edu
- File:
- (in symbol 7499111221A) RJ45 LAN
- (in symbol EM6K6T2R) Tr1; Tr2

### Library data of the parts
C109-C113 = Cap_Taiyo_Yuden_TMK105B7104KV-FR_100nF: CAP CER 100nF 25V X7R 0402; Supplier 1: Mouser; Supplier Part Number 1: 963-TMK105B7104KV-FR
D29 D30 = Diode_SP3003-04ATG_LVDS_ESD: ESD Suppressors / TVS Diodes 4 Ch 8kV 0.65pF SPA; Supplier 1: Mouser; Supplier Part Number 1: 576-SP3003-04ATG
D31 D32 = BZT52C4V3-7-F: Zener Diodes 500mW 4.3V Zener AEC-Q101 Qualified; Vendor: Diodes Inc; Built_By: EMA_UL_Team; Type: DEV; C: Copyright (C) 2015 Accelerated Designs. All rights reserved; Manufacturer_Part_Number: BZT52C4V3-7-F; RefDes: RefDes; Supplier 1: Mouser; Supplier Part Number 1: 621-BZT52C4V3-F; Series: BZT52C4V3-7-F
Q10 Q12-Q14 = Mos_Alpha&Omega_AO3401A_4A: P-Channel 30V 4A (Ta) 1.4W (Ta) Surface Mount SOT-23-3L; Supplier 1: Digi-key; Supplier Part Number 1: 785-1001-1-ND
Q11 = EM6K6T2R: MOSFET Small Signal Dual N-CH 20V .3A .15W; Vendor: ROHM Semiconductor; Manufacturer_Part_Number: EM6K6T2R
R61 R62 = CMP-1012-00070-1: as R147 on sheet DRS4_ADC; Tolerance: 5 %; Technology: SMT; Power: 0.1 W
R63 R65 = CMP-1012-00098-1: as R141 on sheet DRS4_ADC; Technology: SMT; Tolerance: 5 %; Power: 0.1 W
R64 R66 R67 = Res_Vishay_CRCW04020000Z0EDC_0_Ohm: 0R 0.062W 1% 0402 (1005 Metric)  SMD; Supplier 1: Mouser; Supplier Part Number 1: 71-CRCW04020000Z0EDC
T1 = 7499111221A: WE-RJ45 LAN Transformer, 10/100/1000 Base-T, THT, Port 1x1, Tab Up; PoE: non-PoE; LED (Left-Right): green-green; USB: No; ComponentLink1Description: Manufacturer; ComponentLink1URL: http://www.we-online.de; ComponentLink2Description: Datasheet; ComponentLink2URL: http://katalog.we-online.de/pbs/datasheet/7499111221A.pdf; Part Number: 7499111221A; Published Date: Dec. 2017; Publisher: Wurth Elektronik; Tab Position: Up; Port Number: 1x1; Data Rate: 10/100/1000 Base-T; Operating Temperature: 0 to +70 degC; Mounting Technology: THT; Supplier Part Number 1: 710-7499111221A; Supplier 1: Mouser